# EAGLE design Squidpad (EAGLE 7.2.0)
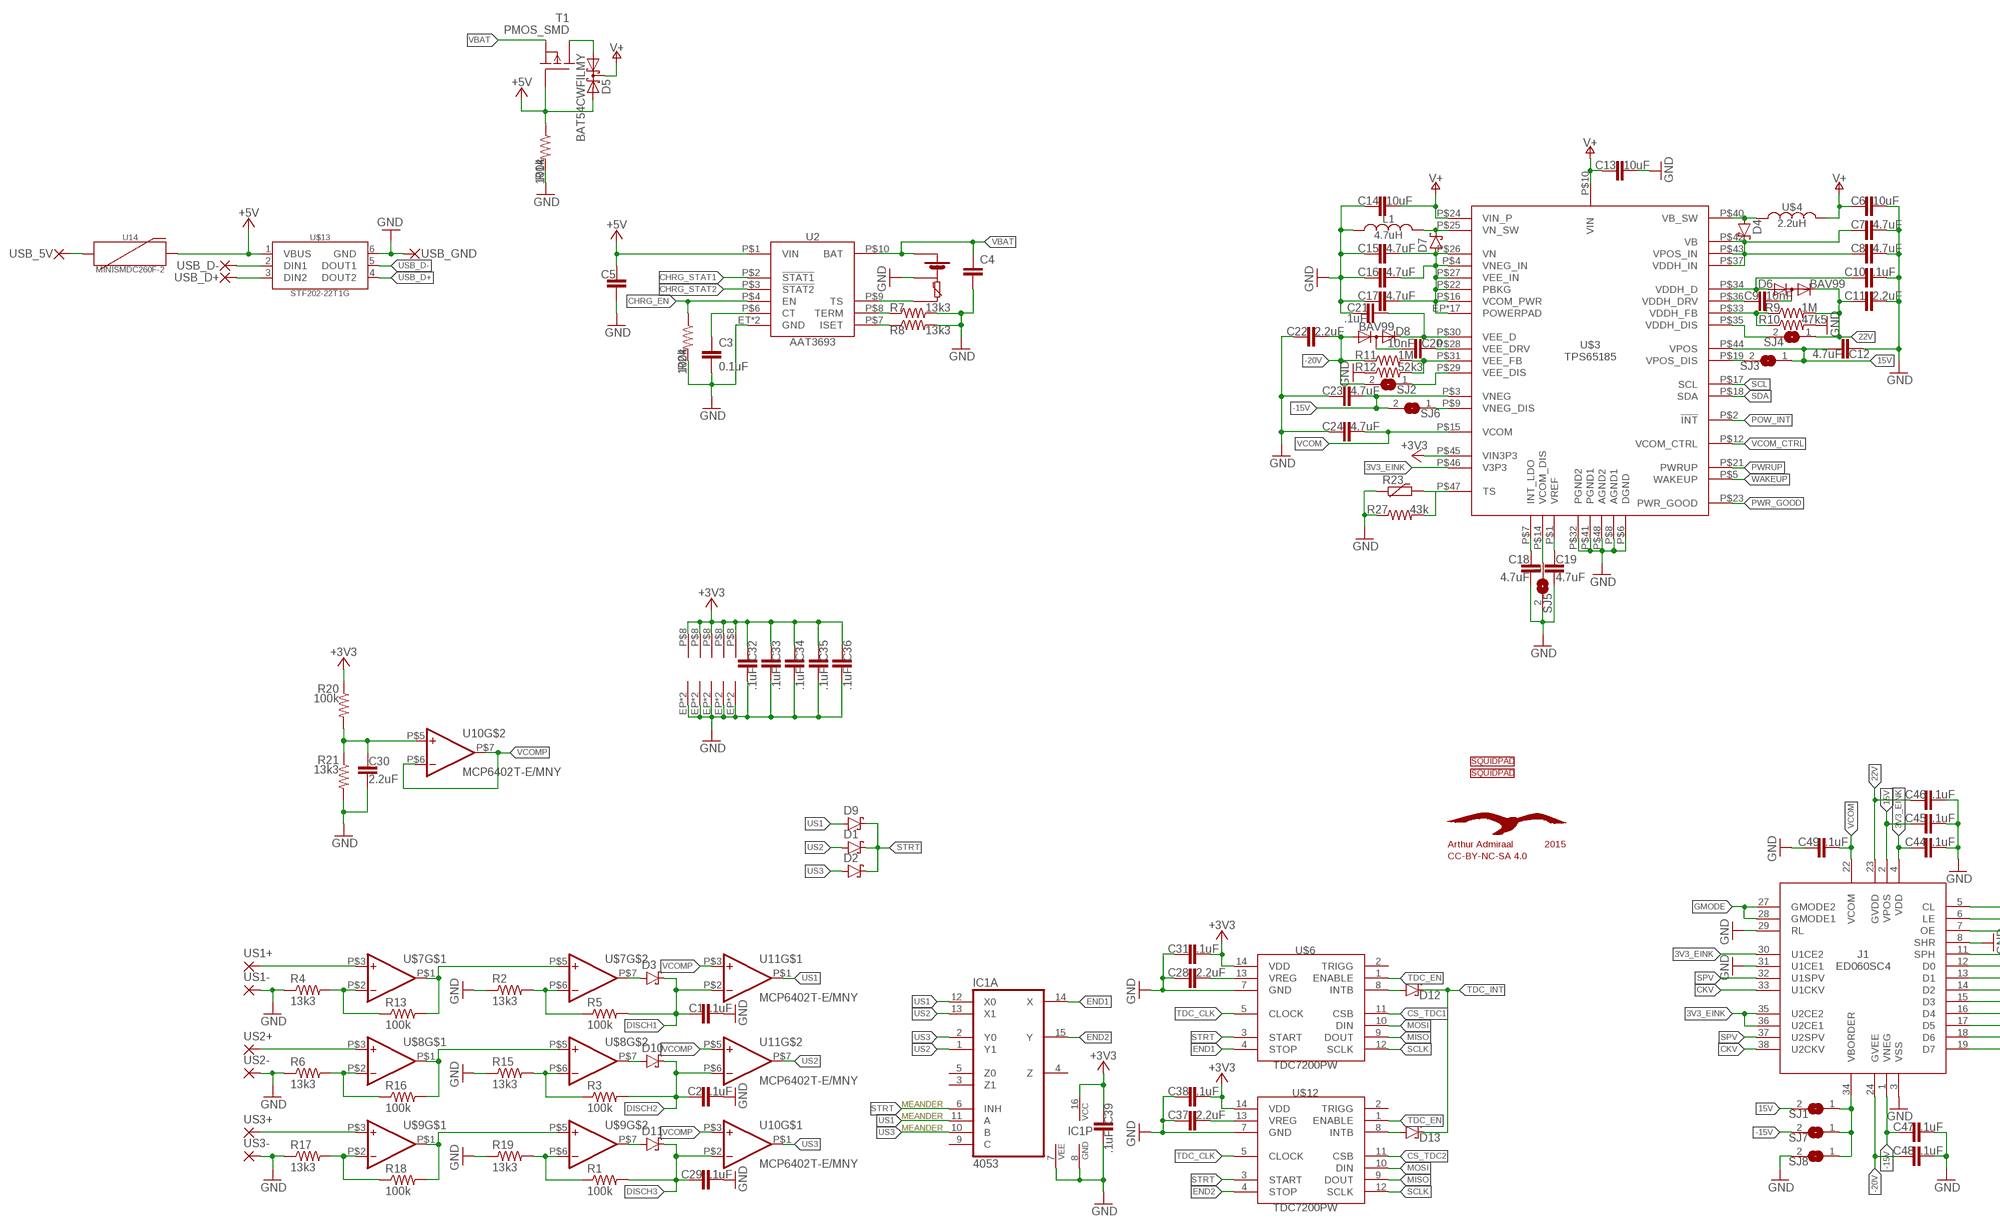
[diagram p0: schematic, sheet 1, part 1 of 2]
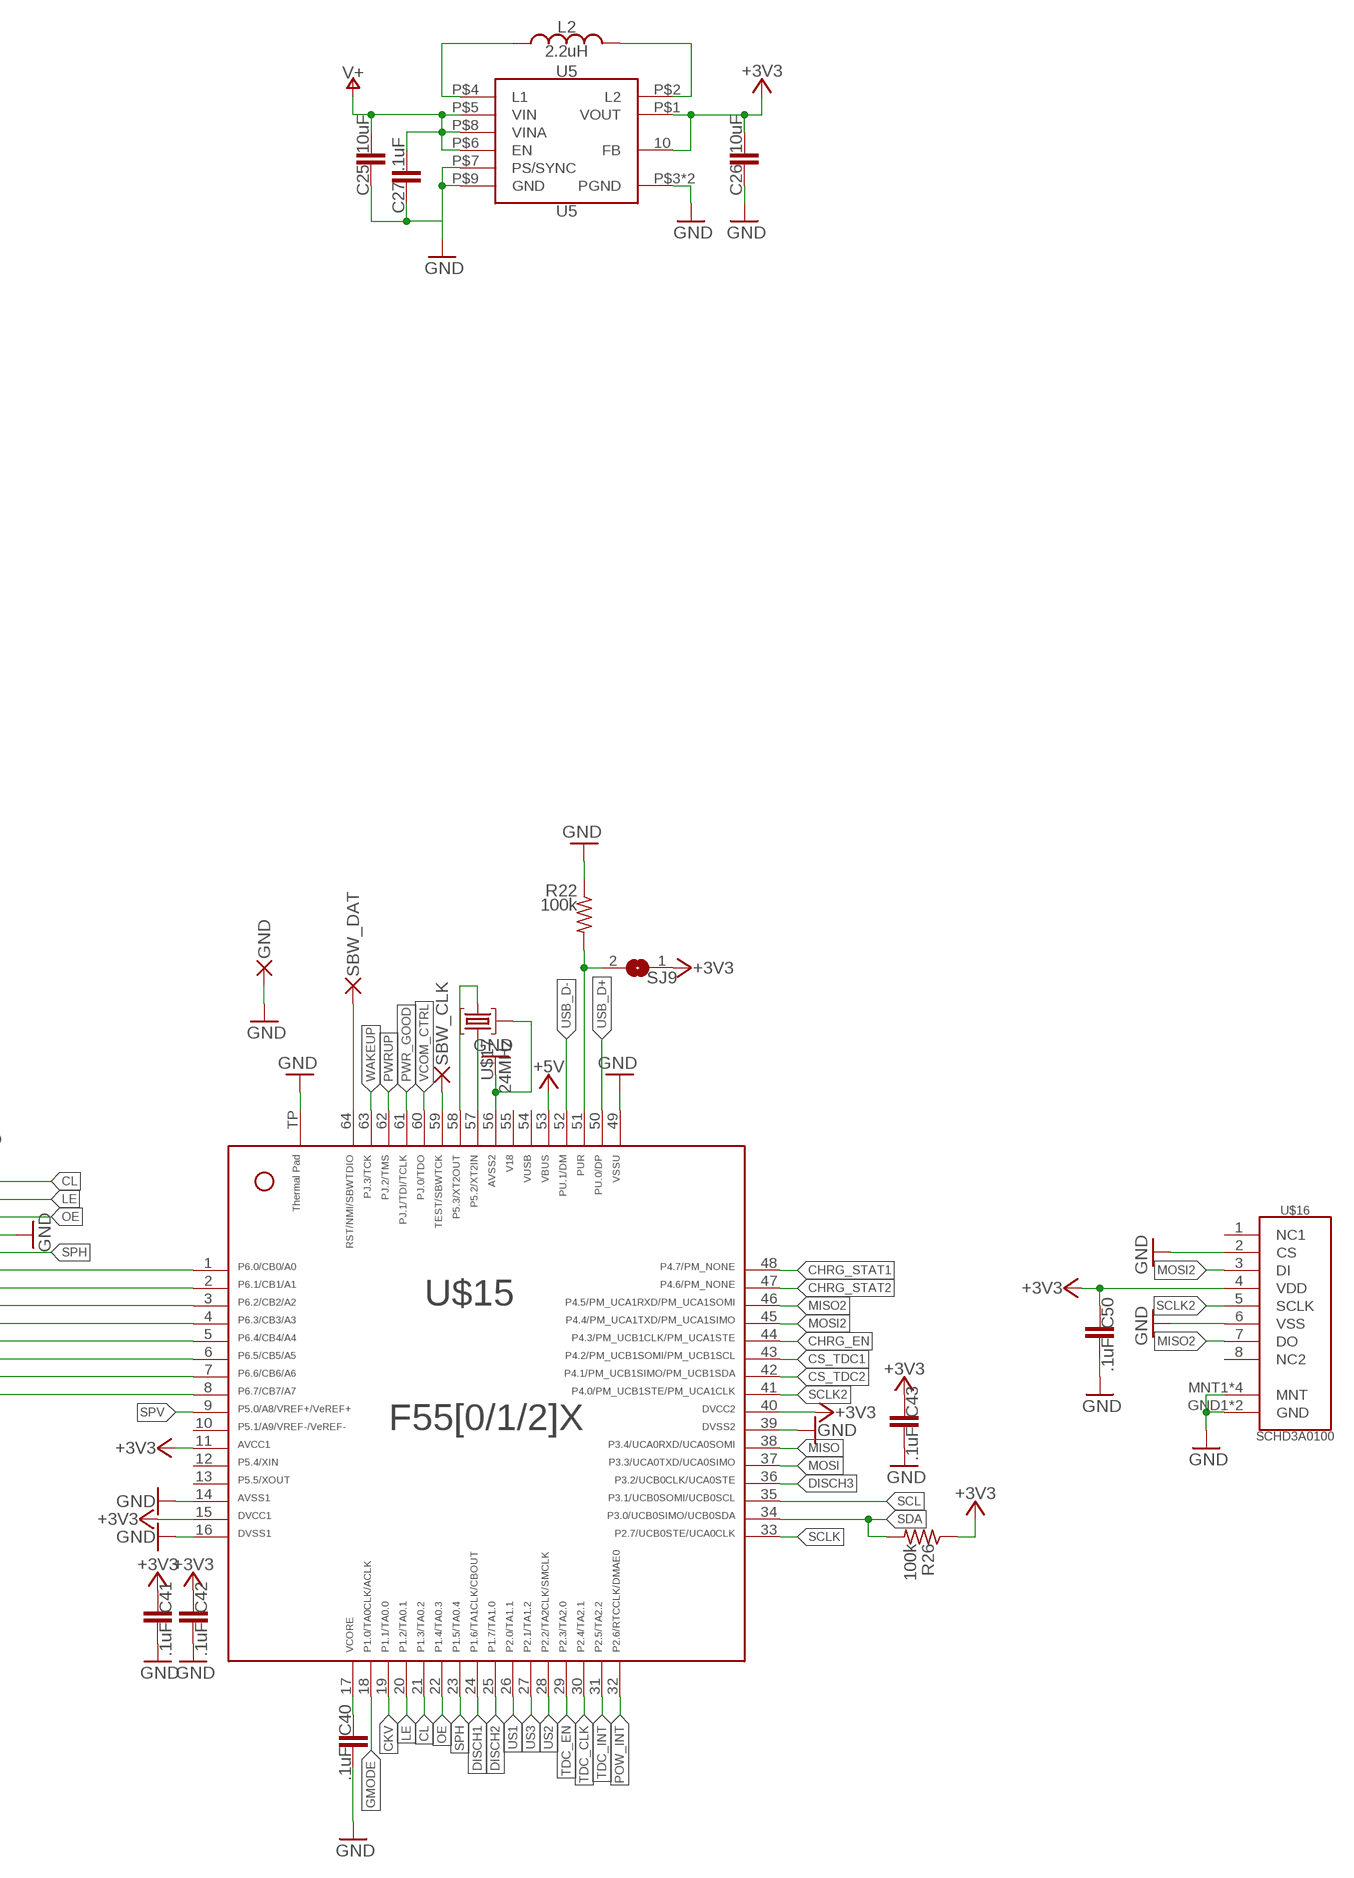
[diagram p1: schematic, sheet 1, part 2 of 2]

## Parts
C1  .1uF  C-EUC0805K  [C0805K]
C2  .1uF  C-EUC0805K  [C0805K]
C3  0.1uF  CAP0603-CAP  [0603-CAP]
C4  CAP0603-CAP  [0603-CAP]
C5  CAP0603-CAP  [0603-CAP]
C6  10uF  C-EUC0805K  [C0805K]
C7  4.7uF  C-EUC0805K  [C0805K]
C8  4.7uF  C-EUC0805K  [C0805K]
C9  10nF  C-EUC0603K  [C0603K]
C10  .1uF  C-EUC0805K  [C0805K]
C11  2.2uF  C-EUC0603K  [C0603K]
C12  4.7uF  C-EUC0805K  [C0805K]
C13  10uF  C-EUC0805K  [C0805K]
C14  10uF  C-EUC0805K  [C0805K]
C15  4.7uF  C-EUC0805K  [C0805K]
C16  4.7uF  C-EUC0805K  [C0805K]
C17  4.7uF  C-EUC0805K  [C0805K]
C18  4.7uF  C-EUC0805K  [C0805K]
C19  4.7uF  C-EUC0805K  [C0805K]
C20  10nF  C-EUC0603K  [C0603K]
C21  .1uF  C-EUC0805K  [C0805K]
C22  2.2uF  C-EUC0603K  [C0603K]
C23  4.7uF  C-EUC0805K  [C0805K]
C24  4.7uF  C-EUC0805K  [C0805K]
C25  10uF  C-EUC0805K  [C0805K]
C26  10uF  C-EUC0805K  [C0805K]
C27  .1uF  C-EUC0805K  [C0805K]
C28  2.2uF  C-EUC0603K  [C0603K]
C29  .1uF  C-EUC0805K  [C0805K]
C30  2.2uF  C-EUC0603K  [C0603K]
C31  .1uF  C-EUC0805K  [C0805K]
C32  .1uF  C-EUC0805K  [C0805K]
C33  .1uF  C-EUC0805K  [C0805K]
C34  .1uF  C-EUC0805K  [C0805K]
C35  .1uF  C-EUC0805K  [C0805K]
C36  .1uF  C-EUC0805K  [C0805K]
C37  2.2uF  C-EUC0603K  [C0603K]
C38  .1uF  C-EUC0805K  [C0805K]
C39  .1uF  C-EUC0805K  [C0805K]
C40  .1uF  C-EUC0805K  [C0805K]
C41  .1uF  C-EUC0805K  [C0805K]
C42  .1uF  C-EUC0805K  [C0805K]
C43  .1uF  C-EUC0805K  [C0805K]
C44  .1uF  C-EUC0805K  [C0805K]
C45  .1uF  C-EUC0805K  [C0805K]
C46  .1uF  C-EUC0805K  [C0805K]
C47  .1uF  C-EUC0805K  [C0805K]
C48  .1uF  C-EUC0805K  [C0805K]
C49  .1uF  C-EUC0805K  [C0805K]
C50  .1uF  C-EUC0805K  [C0805K]
D1  MBR130T3G  [SOD123]
D2  MBR130T3G  [SOD123]
D3  MBR130T3G  [SOD123]
D4  MBR130T3G  [SOD123]
D5  BAT54CWFILMY  HSMS-285F  [SOT323]
D6  BAV99  BAV199  [SOT23]
D7  MBR130T3G  [SOD123]
D8  BAV99  BAV199  [SOT23]
D9  MBR130T3G  [SOD123]
D10  MBR130T3G  [SOD123]
D11  MBR130T3G  [SOD123]
D12  MBR130T3G  [SOD123]
D13  MBR130T3G  [SOD123]
GND  SMD2  [SMD1,27-2,54]
IC1  4053  [TSSOP16]
J1  ED060SC4  [FH26-39S-0.3SHW(05)]
L1  4.7uH  LQH44P  [LQH44P]
L2  2.2uH  NR4012  [NR4012]
R1  100k  R-US_R0603  [R0603]
R2  13k3  R-US_R1206  [R1206]
R3  100k  R-US_R0603  [R0603]
R4  13k3  R-US_R1206  [R1206]
R5  100k  R-US_R0603  [R0603]
R6  13k3  R-US_R1206  [R1206]
R7  13k3  R-US_R0603  [R0603]
R8  13k3  R-US_R0603  [R0603]
R9  1M  R-US_R0603  [R0603]
R10  47k5  R-US_R0603  [R0603]
R11  1M  R-US_R0603  [R0603]
R12  52k3  R-US_R0603  [R0603]
R13  100k  R-US_R0603  [R0603]
R14  100k  R-US_R0603  [R0603]
R15  13k3  R-US_R1206  [R1206]
R16  100k  R-US_R0603  [R0603]
R17  13k3  R-US_R1206  [R1206]
R18  100k  R-US_R0603  [R0603]
R19  13k3  R-US_R1206  [R1206]
R20  100k  R-US_R0603  [R0603]
R21  13k3  R-US_R1206  [R1206]
R22  100k  R-US_R0603  [R0603]
R23  R-EU_R0603  [R0603]
R24  100k  R-US_R0603  [R0603]
R26  100k  R-US_R0603  [R0603]
R27  43k  R-US_R0603  [R0603]
SBW_CLK  SMD2  [SMD1,27-2,54]
SBW_DAT  SMD2  [SMD1,27-2,54]
SJ1  SJ  [SJ]
SJ2  SJ  [SJ]
SJ3  SJ  [SJ]
SJ4  SJ  [SJ]
SJ5  SJ  [SJ]
SJ6  SJ  [SJ]
SJ7  SJ  [SJ]
SJ8  SJ  [SJ]
SJ9  SJ  [SJ]
T1  PMOS_SMD  [SOT323R_INFINEON]
U2  AAT3693  [TDFN14]
U5  TPS63031  [R-PWSON-N10]
U10  MCP6402T-E/MNY  [TFDN8]
U11  MCP6402T-E/MNY  [TFDN8]
U14  MINISMDC260F-2  [MINISMDC260F-2]
U$1  IPOD_NANO_5_BATTERY  [IPOD_NANO_5_BATTERY]
U$2  SQUIDPAD_LOGOSQUIDPAD_LOGO_SMALL  [SQUIDPAD_LOGO_LOWPOLY_SMALL]
U$3  TPS65185  [VQFN48]
U$4  2.2uH  NR4012  [NR4012]
U$5  SQUIDPAD_LOGOSQUIDPAD_LOGO  [SQUIDPAD_LOGO_LOWPOLY]
U$6  TDC7200PW  [TSSOP14]
U$7  MCP6402T-E/MNY  [TFDN8]
U$8  MCP6402T-E/MNY  [TFDN8]
U$9  MCP6402T-E/MNY  [TFDN8]
U$10  AALECTRONICS_SEAGULL  [AALECTRONICS_SEAGULL]
U$12  TDC7200PW  [TSSOP14]
U$13  STF202-22T1G  [SOT23-6]
U$15  F55[0/1/2]X---RGC64  [RGC64]
U$16  SCHD3A0100  [SCHD3A0100]
U$17  24MHz  CRYSTAL_TSX-3225  [TSX-3225]
US1+  SMD2  [SMD1,27-2,54]
US1-  SMD2  [SMD1,27-2,54]
US2+  SMD2  [SMD1,27-2,54]
US2-  SMD2  [SMD1,27-2,54]
US3+  SMD2  [SMD1,27-2,54]
US3-  SMD2  [SMD1,27-2,54]
USB_5V  SMD2  [SMD1,27-2,54]
USB_D+  SMD2  [SMD1,27-2,54]
USB_D-  SMD2  [SMD1,27-2,54]
USB_GND  SMD2  [SMD1,27-2,54]

## Nets
3V3: C6.1 C13.1 C14.2 C25.2 C27.2 D5.3(C) U5.P$5(VIN) U5.P$6(EN) U5.P$8(VINA) U$3.P$10(VIN) U$3.P$24(VIN_P) U$4.P$2 ; supply symbol labelled V+
3V3_EINK: C44.1 J1.4(VDD) J1.30(U1CE2) J1.35(U2CE2) J1.36(U2CE1) U$3.P$46(V3P3)
15V: C12.2 C45.1 J1.2(VPOS) SJ1.2 SJ3.1 U$3.P$44(VPOS)
22V: C11.1 C46.1 D6.2(C) J1.23(GVDD) R9.2 SJ4.1
+3V3: C26.2 C31.2 C32.1 C33.1 C34.1 C35.1 C36.1 C38.2 C39.1 C41.1 C42.1 C43.1 C50.1 IC1.16(P:VCC) R20.1 R26.1 SJ9.1 U5.10(FB) U5.P$1(VOUT) U10.P$8(V+) U11.P$8(V+) U$3.P$45(VIN3P3) U$6.14(VDD) U$7.P$8(V+) U$8.P$8(V+) U$9.P$8(V+) U$12.14(VDD) U$15.11 U$15.15 U$15.40 U$16.4(VDD)
+5V: C5.1 D5.2(A2) R14.1 T1.1(G) U2.P$1(VIN) U14.P$2 U$13.1(VBUS) U$15.53
-15V: C23.2 C47.1 J1.1(VNEG) SJ6.2 SJ7.2 U$3.P$3(VNEG)
-20V: C22.2 C48.1 D8.1(A) J1.24(GVEE) R11.1 SJ2.2
CHRG_EN: R24.1 U2.P$4(EN) U$15.44
CHRG_STAT1: U2.P$2(!STAT1) U$15.48
CHRG_STAT2: U2.P$3(!STAT2) U$15.47
CKV: J1.33(U1CKV) J1.38(U2CKV) U$15.19
CL: J1.5(CL) U$15.21
CS_TDC1: U$6.11(CSB) U$15.43
CS_TDC2: U$12.11(CSB) U$15.42
D0: J1.12(D0) U$15.1
D1: J1.13(D1) U$15.2
D2: J1.14(D2) U$15.3
D3: J1.15(D3) U$15.4
D4: J1.16(D4) U$15.5
D5: J1.17(D5) U$15.6
D6: J1.18(D6) U$15.7
D7: J1.19(D7) U$15.8
DISCH1: C1.1 D3.1(C) R5.2 U11.P$2(-IN) U$15.24
DISCH2: C2.1 D10.1(C) R3.2 U11.P$6(-IN) U$15.25
DISCH3: C29.1 D11.1(C) R1.2 U10.P$2(-IN) U$15.36
END1: IC1.14(A:X) U$6.4(STOP)
END2: IC1.15(A:Y) U$12.4(STOP)
GMODE: J1.27(GMODE2) J1.28(GMODE1) U$15.18
GND: C1.2 C2.2 C3.2 C4.2 C5.2 C6.2 C7.2 C8.2 C10.2 C11.2 C12.1 C13.2 C14.1 C15.1 C16.1 C17.1 C18.1 C19.1 C21.1 C22.1 C23.1 C24.1 C25.1 C26.1 C27.1 C28.1 C29.2 C30.2 C31.1 C32.2 C33.2 C34.2 C35.2 C36.2 C37.1 C38.1 C39.2 C40.2 C41.2 C42.2 C43.2 C44.2 C45.2 C46.2 C47.2 C48.2 C49.1 C50.2 GND.1(P) IC1.7(P:VEE) IC1.8(P:GND) J1.3(VSS) J1.8(SHR) J1.29(RL) J1.31(U1CE1) L1.P$1 R2.1 R4.1 R6.1 R7.2 R8.2 R10.2 R12.1 R14.2 R15.1 R17.1 R19.1 R21.2 R22.1 R23.1 R24.2 R27.1 SJ5.2 SJ8.2 U2.ET(GND) U2.P$5(GND) U5.P$3(PGND) U5.P$7(PS/SYNC) U5.P$9(GND) U5.POWERPAD(PGND) U10.EP(V-) U10.P$4(V-) U11.EP(V-) U11.P$4(V-) U$1.P-(BATTERY-) U$3.P$6(DGND) U$3.P$8(AGND1) U$3.P$32(PGND2) U$3.P$41(PGND1) U$3.P$48(AGND2) U$6.7(GND) U$7.EP(V-) U$7.P$4(V-) U$8.EP(V-) U$8.P$4(V-) U$9.EP(V-) U$9.P$4(V-) U$12.7(GND) U$13.6(GND) U$15.14 U$15.16 U$15.39 U$15.49 U$15.56 U$15.TP U$16.2(CS) U$16.6(VSS) U$16.GND1(GND) U$16.GND2(GND) U$16.MNT1(MNT) U$16.MNT2(MNT) U$16.MNT3(MNT) U$16.MNT4(MNT) U$17.2 U$17.3 US1-.1(P) US2-.1(P) US3-.1(P) USB_GND.1(P)
LE: J1.6(LE) U$15.20
MISO: U$6.9(DOUT) U$12.9(DOUT) U$15.38
MISO2: U$15.46 U$16.7(DO)
MOSI: U$6.10(DIN) U$12.10(DIN) U$15.37
MOSI2: U$15.45 U$16.3(DI)
N$1: U$7.P$3(+IN) US1+.1(P)
N$2: R2.2 R5.1 U$7.P$6(-IN)
N$3: D12.2(A) U$6.8(INTB)
N$4: U$8.P$3(+IN) US2+.1(P)
N$5: R6.2 R16.1 U$8.P$2(-IN)
N$6: R16.2 U$8.P$1(OUT) U$8.P$5(+IN)
N$7: D4.2(A) U$3.P$40(VB_SW) U$4.P$1
N$8: U2.P$9(TS) U$1.TH(TEMP)
N$9: U$13.3(DIN2) USB_D+.1(P)
N$10: U$13.2(DIN1) USB_D-.1(P)
N$11: U$15.57 U$17.4
N$12: R7.1 U2.P$8(TERM)
N$13: R8.1 U2.P$7(ISET)
N$14: C7.1 C8.1 D4.1(C) U$3.P$37(VDDH_IN) U$3.P$42(VB) U$3.P$43(VPOS_IN)
N$15: D3.2(A) U$7.P$7(OUT)
N$16: D13.2(A) U$12.8(INTB)
N$17: C3.1 U2.P$6(CT)
N$18: C10.1 D6.1(A) U$3.P$34(VDDH_D)
N$19: D5.1(A1) T1.3(D)
N$20: C9.1 U$3.P$36(VDDH_DRV)
N$21: C9.2 D6.3(AC)
N$22: R9.1 R10.1 U$3.P$33(VDDH_FB)
N$23: C20.2 D8.3(AC)
N$24: D7.1(C) L1.P$2 U$3.P$25(VN_SW)
N$25: C15.2 C16.2 C17.2 D7.2(A) U$3.EP1(POWERPAD) U$3.EP2(POWERPAD) U$3.EP3(POWERPAD) U$3.EP4(POWERPAD) U$3.EP5(POWERPAD) U$3.EP6(POWERPAD) U$3.EP7(POWERPAD) U$3.EP8(POWERPAD) U$3.EP9(POWERPAD) U$3.EP10(POWERPAD) U$3.EP11(POWERPAD) U$3.EP12(POWERPAD) U$3.EP13(POWERPAD) U$3.EP14(POWERPAD) U$3.EP15(POWERPAD) U$3.EP16(POWERPAD) U$3.EP(POWERPAD) U$3.P$4(VNEG_IN) U$3.P$16(VCOM_PWR) U$3.P$22(PBKG) U$3.P$26(VN) U$3.P$27(VEE_IN)
N$26: C18.2 U$3.P$7(INT_LDO)
N$27: C19.2 U$3.P$1(VREF)
N$28: C21.2 D8.2(C) U$3.P$30(VEE_D)
N$29: SJ6.1 U$3.P$9(VNEG_DIS)
N$30: L2.P$1 U5.P$4(L1)
N$31: C20.1 U$3.P$28(VEE_DRV)
N$32: R11.2 R12.2 U$3.P$31(VEE_FB)
N$33: SJ2.1 U$3.P$29(VEE_DIS)
N$34: SJ3.2 U$3.P$19(VPOS_DIS)
N$35: SJ4.2 U$3.P$35(VDDH_DIS)
N$36: SJ5.1 U$3.P$14(VCOM_DIS)
N$37: L2.P$2 U5.P$2(L2)
N$38: C28.2 U$6.13(VREG)
N$39: R4.2 R13.1 U$7.P$2(-IN)
N$40: R13.2 U$7.P$1(OUT) U$7.P$5(+IN)
N$41: R3.1 R15.2 U$8.P$6(-IN)
N$42: U14.P$1 USB_5V.1(P)
N$43: U$9.P$3(+IN) US3+.1(P)
N$44: R17.2 R18.1 U$9.P$2(-IN)
N$45: R18.2 U$9.P$1(OUT) U$9.P$5(+IN)
N$46: R1.1 R19.2 U$9.P$6(-IN)
N$47: D10.2(A) U$8.P$7(OUT)
N$48: D11.2(A) U$9.P$7(OUT)
N$49: C37.2 U$12.13(VREG)
N$50: J1.34(VBORDER) SJ1.1 SJ7.1 SJ8.1
N$51: SBW_DAT.1(P) U$15.64
N$52: SBW_CLK.1(P) U$15.59
N$53: C40.1 U$15.17
N$54: R22.2 SJ9.2 U$15.51
N$56: U$15.58 U$17.1
N$57: R23.2 R27.2 U$3.P$47(TS)
OE: J1.7(OE) U$15.22
POW_INT: U$3.P$2(!INT) U$15.32
PWR_GOOD: U$3.P$23(PWR_GOOD) U$15.61
PWRUP: U$3.P$21(PWRUP) U$15.62
SCL: U$3.P$17(SCL) U$15.35
SCLK: U$6.12(SCLK) U$12.12(SCLK) U$15.33
SCLK2: U$15.41 U$16.5(SCLK)
SDA: R26.2 U$3.P$18(SDA) U$15.34
SPH: J1.11(SPH) U$15.23
SPV: J1.32(U1SPV) J1.37(U2SPV) U$15.9
STRT: D1.1(C) D2.1(C) D9.1(C) IC1.6(A:INH) U$6.3(START) U$12.3(START)
TDC_CLK: U$6.5(CLOCK) U$12.5(CLOCK) U$15.30
TDC_EN: U$6.1(ENABLE) U$12.1(ENABLE) U$15.29
TDC_INT: D12.1(C) D13.1(C) U$15.31
US1: D9.2(A) IC1.11(A:A) IC1.12(A:X0) U11.P$1(OUT) U$15.26
US2: D1.2(A) IC1.1(A:Y1) IC1.13(A:X1) U11.P$7(OUT) U$15.28
US3: D2.2(A) IC1.2(A:Y0) IC1.10(A:B) U10.P$1(OUT) U$15.27
USB_D+: U$13.4(DOUT2) U$15.50
USB_D-: U$13.5(DOUT1) U$15.52
VBAT: C4.1 T1.2(S) U2.P$10(BAT) U$1.P+(BATTERY+)
VCOM: C24.2 C49.2 J1.22(VCOM) U$3.P$15(VCOM)
VCOM_CTRL: U$3.P$12(VCOM_CTRL) U$15.60
VCOMP: U10.P$3(+IN) U10.P$6(-IN) U10.P$7(OUT) U11.P$3(+IN) U11.P$5(+IN)
VCOMP_BEFORE: C30.1 R20.2 R21.1 U10.P$5(+IN)
WAKEUP: U$3.P$5(WAKEUP) U$15.63
Unconnected: IC1.3(A:Z1) IC1.4(A:Z) IC1.5(A:Z0) IC1.9(A:C) U$6.2(TRIGG) U$12.2(TRIGG) U$15.10 U$15.12 U$15.13 U$16.1(NC1) U$16.8(NC2)

## Notes on the sheet
- MEANDER
- MEANDER
- MEANDER

## Power pins joined to a net without a drawn wire
54: U$15.54
55: U$15.55

## Library data of the parts
C1 C2 C6-C50 = rcl:C-EU: CAPACITOR, European symbol
C3-C5 = SparkFun-Capacitors:CAP: Capacitor Standard 0603 ceramic capacitor, and 0.1" leaded capacitor.
D1-D4 D7 D9-D13 = aalectronics:MBR130T3G
D5 = avago:HSMS-285F: Surface Mount Microwave Schottky Detector Diodes Source: Data sheet <http://www.farnell.com/datasheets/461166.pdf>
D6 D8 = diode:BAV199: DIODE low-leakage double diode
GND SBW_CLK SBW_DAT US1+ US1- US2+ US2- US3+ US3- USB_5V USB_D+ USB_D- USB_GND = wirepad:SMD2: SMD PAD
IC1 = aalectronics:4053: Triple 2-channel ANALOG MULTIPLEXER
J1 = aalectronics:ED060SC4
L1 = aalectronics:LQH44P
L2 U$4 = aalectronics:NR4012
R1 R3 R5 R9-R13 R16 R18 R20 R22 R26 R27 = rcl:R-US_: RESISTOR, American symbol
R2 R4 R6-R8 R14 R15 R17 R19 R21 R24 = resistor:R-US_: RESISTOR, American symbol
R23 = rcl:R-EU_: RESISTOR, European symbol
SJ1-SJ9 = jumper:SJ: SMD solder JUMPER
T1 = aalectronics:PMOS_SMD
U2 = aalectronics:AAT3693
U5 = aalectronics:TPS63031
U10 U11 U$7-U$9 = aalectronics:MCP6402T-E/MNY
U14 = aalectronics:MINISMDC260F-2
U$1 = aalectronics:IPOD_NANO_5_BATTERY
U$2 U$5 = aalectronics:SQUIDPAD_LOGO
U$3 = aalectronics:TPS65185
U$6 U$12 = aalectronics:TDC7200PW
U$10 = aalectronics:AALECTRONICS_SEAGULL
U$13 = aalectronics:STF202-22T1G
U$15 = TI_MSP430_v16:F55[0/1/2]X---RGC64: ***F55[0/1/2]X***RGC64 Rev. 1.0 06/2010 "http://www.ti.com/lit/gpn/msp430f5529" "http://www.ti.com/lit/gpn/msp430f5509" F5513/F5514 with limited Functions on some Pins
U$16 = aalectronics:SCHD3A0100
U$17 = aalectronics:CRYSTAL_TSX-3225

## Board
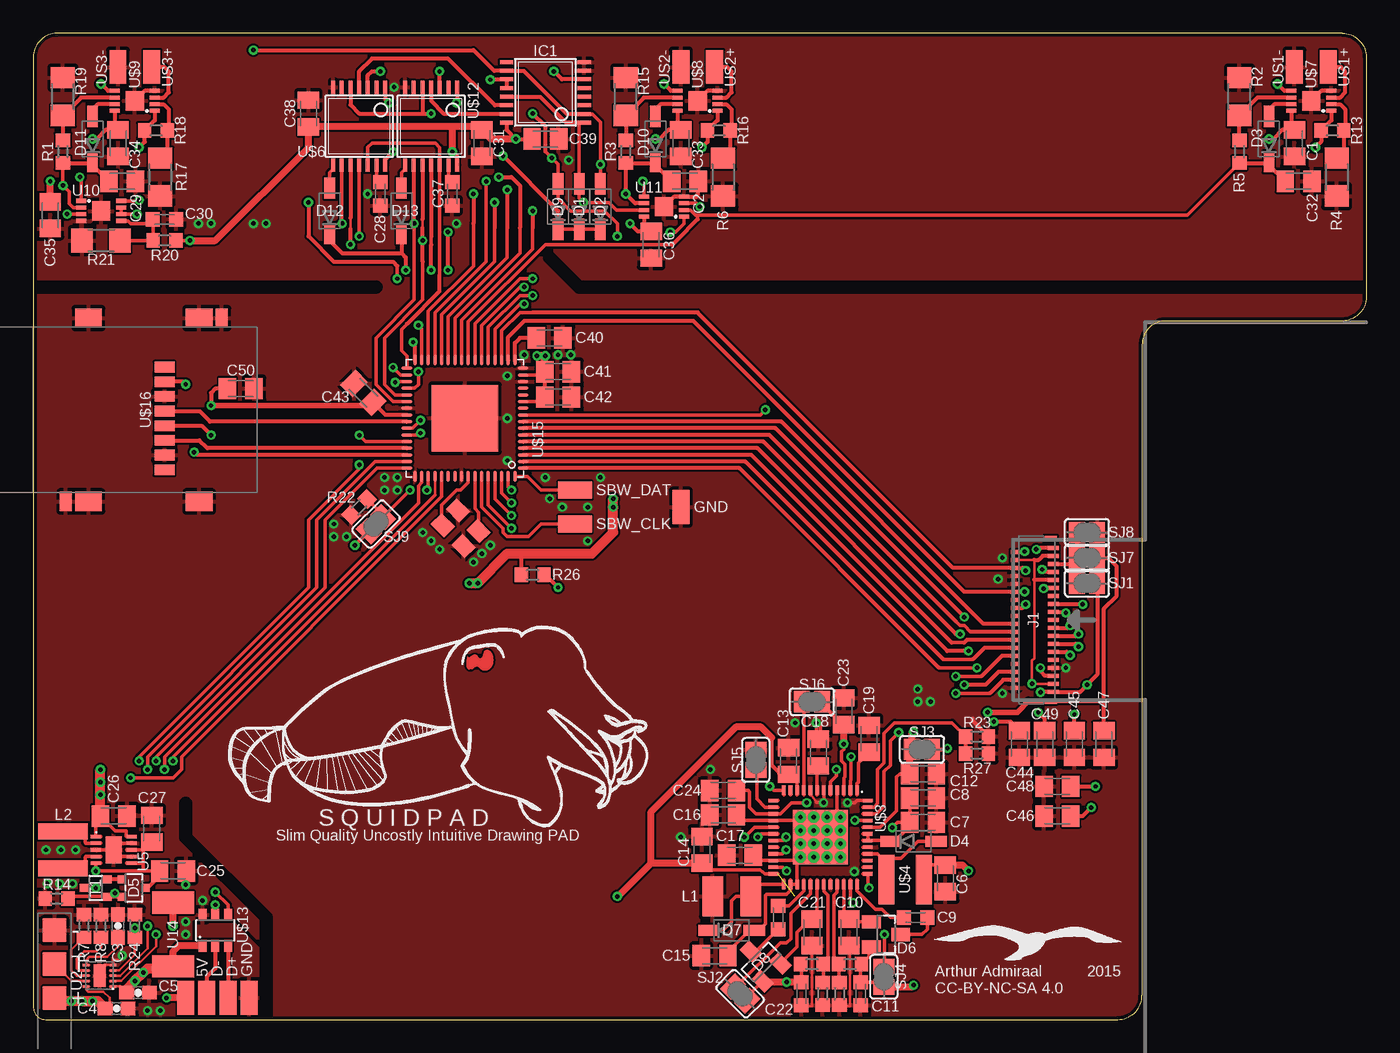
[diagram p2: board, top side]
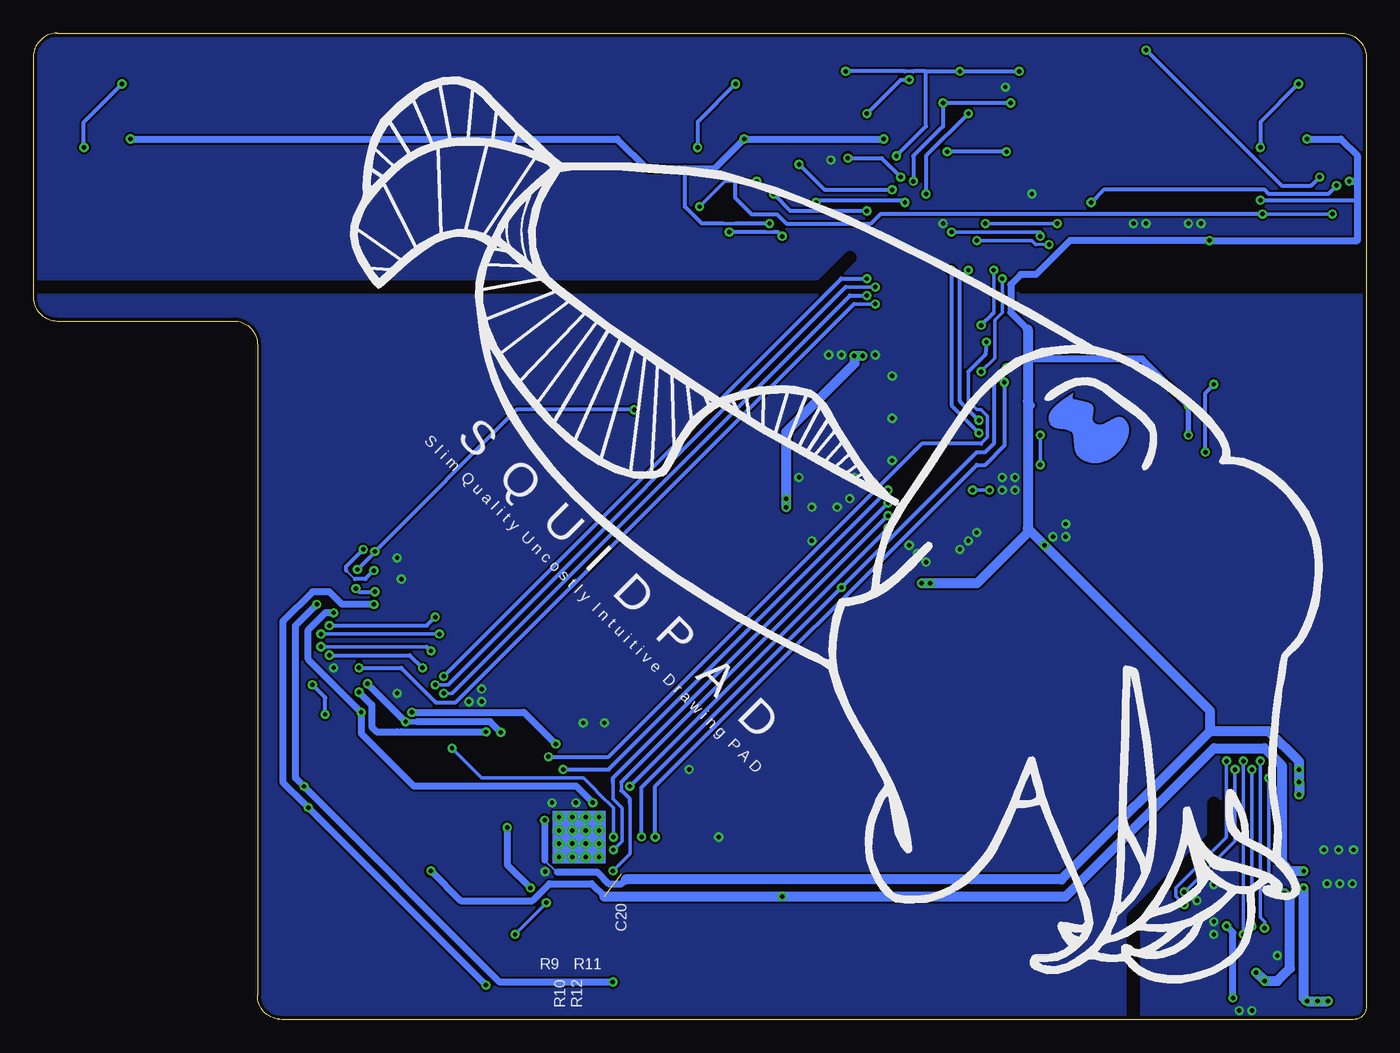
[diagram p3: board, bottom side, seen from below]

Size 100 x 74 mm. Coordinates in mm from the lower left corner, seen from the top.
Outline: 0,72.21 0,0.92 arc90 0.92,0 81.37,0 arc90 83.19,1.82 83.19,50.62 arc-90 84.98,52.42 98.21,52.42 arc90 100,54.21 100,72.22 arc90 98.22,74 1.79,74 arc90 0,72.21
Copper layers (1*16): Top 0.035mm / dielectric 1.5mm / Bottom 0.035mm
Design rules "itead": minimum track width 6mil, minimum drill 12mil, track to track 6mil, track to pad 6mil, pad to pad 6mil, via to via 6mil, smd to smd 0mil, copper to edge 10mil, drill to drill 10mil, minimum pad ring 10mil, minimum via ring 6mil, stop-mask expansion 2mil, vias tented up to drill 100mil, thermal gap 10mil
tRestrict: 9 lines
bRestrict: 6 lines

### Footprints (pad centres in the part's own frame; a part is rotated, then mirrored left to right if it is on the bottom)
C0805K = smd 1.3 x 1.6: 1 -1,0; 2 1,0
0603-CAP = smd 1.1 x 1: 1 -0.85,0; 2 0.85,0
C0603K = smd 1.05 x 1.08: 1 -0.875,0; 2 0.875,0
SOD123 = smd 1.6 x 0.8: 1 -1.7,0; 2 1.7,0
SOT323 = smd 0.6 x 0.55: 1 -0.65,-0.925; 2 0.65,-0.925; 3 0,0.925
SOT23 = smd 1 x 1.4: 1 -0.95,-1.1; 2 0.95,-1.1; 3 0,1.1
SMD1,27-2,54 = smd 1.27 x 2.54: 1 0,0
TSSOP16 = smd 0.305 x 0.991: 1 -2.275,-2.918; 2 -1.625,-2.918; 3 -0.975,-2.918; 4 -0.325,-2.918; 5 0.325,-2.918; 6 0.975,-2.918; 7 1.625,-2.918; 8 2.275,-2.918; 9 2.275,2.918; 10 1.625,2.918; 11 0.975,2.918; 12 0.325,2.918; 13 -0.325,2.918; 14 -0.975,2.918; 15 -1.625,2.918; 16 -2.275,2.918
FH26-39S-0.3SHW(05) = smd 0.4 x 0.95: 1 -6.1,-2.325; 39 6.1,-2.325 | smd 0.3 x 0.8: 2 -5.4,-2.525; 4 -4.8,-2.525; 6 -4.2,-2.525; 8 -3.6,-2.525; 10 -3,-2.525; 12 -2.4,-2.525; 14 -1.8,-2.525; 16 -1.2,-2.525; 18 -0.6,-2.525; 20 0,-2.525; 22 0.6,-2.525; 24 1.2,-2.525; 26 1.8,-2.525; 28 2.4,-2.525; 30 3,-2.525; 32 3.6,-2.525; 34 4.2,-2.525; 36 4.8,-2.525; 38 5.4,-2.525 | smd 0.3 x 0.65: 3 -5.1,0.35; 5 -4.5,0.35; 7 -3.9,0.35; 9 -3.3,0.35; 11 -2.7,0.35; 13 -2.1,0.35; 15 -1.5,0.35; 17 -0.9,0.35; 19 -0.3,0.35; 21 0.3,0.35; 23 0.9,0.35; 25 1.5,0.35; 27 2.1,0.35; 29 2.7,0.35; 31 3.3,0.35; 33 3.9,0.35; 35 4.5,0.35; 37 5.1,0.35
LQH44P = smd 1.55 x 3: P$1 -1.425,0; P$2 1.425,0
NR4012 = smd 1.2 x 3.7: P$1 -1.4,0; P$2 1.4,0
R0603 = smd 1 x 1.1: 1 -0.85,0; 2 0.85,0
R1206 = smd 1.6 x 1.803: 1 -1.422,0; 2 1.422,0
SJ = smd 1.168 x 1.6: 1 -0.762,0; 2 0.762,0
SOT323R_INFINEON = smd 0.6 x 0.8: 1 -0.65,-0.8; 2 0,0.8; 3 0.65,-0.8
TDFN14 = smd 0.9 x 1.7: ET 0,0 | smd 0.465 x 0.18: P$1 -1.022,0.8; P$2 -1.022,0.4; P$3 -1.022,0; P$4 -1.022,-0.4; P$5 -1.022,-0.8; P$6 1.022,-0.8; P$7 1.022,-0.4; P$8 1.022,0; P$9 1.022,0.4; P$10 1.022,0.8
R-PWSON-N10 = smd 0.73 x 0.28: 10 1.355,1; P$1 -1.355,1; P$2 -1.355,0.5; P$3 -1.355,0; P$4 -1.355,-0.5; P$5 -1.355,-1; P$6 1.355,-1; P$7 1.355,-0.5; P$8 1.355,0; P$9 1.355,0.5 | smd 1.2 x 2: POWERPAD 0,0
TFDN8 = smd 1.46 x 1.36: EP 0,0 | smd 0.3 x 0.75: P$1 -0.75,-1.5; P$2 -0.25,-1.5; P$3 0.25,-1.5; P$4 0.75,-1.5; P$5 0.75,1.5; P$6 0.25,1.5; P$7 -0.25,1.5; P$8 -0.75,1.5
MINISMDC260F-2 = smd 1.68 x 3.15: P$1 -2.39,0; P$2 2.39,0
IPOD_NANO_5_BATTERY = smd 1.778 x 1.778: P+ 5.08,0; P- 0,0; TH 2.54,0
VQFN48 = smd 4.1 x 4.1: EP 0,0 | drill 0.33: EP1 -1.5,1.5; EP2 -0.5,1.5; EP3 0.5,1.5; EP4 1.5,1.5; EP5 1.5,0.5; EP6 1.5,-0.5; EP7 1.5,-1.5; EP8 0.5,-1.5; EP9 -0.5,-1.5; EP10 -1.5,-1.5; EP11 -1.5,-0.5; EP12 -1.5,0.5; EP13 0.5,-0.5; EP14 -0.5,0.5; EP15 0.5,0.5; EP16 -0.5,-0.5 | smd 0.71 x 0.28: P$1 -3.545,2.75; P$2 -3.545,2.25; P$3 -3.545,1.75; P$4 -3.545,1.25; P$5 -3.545,0.75; P$6 -3.545,0.25; P$7 -3.545,-0.25; P$8 -3.545,-0.75; P$9 -3.545,-1.25; P$10 -3.545,-1.75; P$11 -3.545,-2.25; P$12 -3.545,-2.75; P$25 3.545,-2.75; P$26 3.545,-2.25; P$27 3.545,-1.75; P$28 3.545,-1.25; P$29 3.545,-0.75; P$30 3.545,-0.25; P$31 3.545,0.25; P$32 3.545,0.75; P$33 3.545,1.25; P$34 3.545,1.75; P$35 3.545,2.25; P$36 3.545,2.75 | smd 0.28 x 0.71: P$13 -2.75,-3.545; P$14 -2.25,-3.545; P$15 -1.75,-3.545; P$16 -1.25,-3.545; P$17 -0.75,-3.545; P$18 -0.25,-3.545; P$19 0.25,-3.545; P$20 0.75,-3.545; P$21 1.25,-3.545; P$22 1.75,-3.545; P$23 2.25,-3.545; P$24 2.75,-3.545; P$37 2.75,3.545; P$38 2.25,3.545; P$39 1.75,3.545; P$40 1.25,3.545; P$41 0.75,3.545; P$42 0.25,3.545; P$43 -0.25,3.545; P$44 -0.75,3.545; P$45 -1.25,3.545; P$46 -1.75,3.545; P$47 -2.25,3.545; P$48 -2.75,3.545
TSSOP14 = smd 0.305 x 0.991: 1 -1.95,-2.918; 2 -1.3,-2.918; 3 -0.65,-2.918; 4 0,-2.918; 5 0.65,-2.918; 6 1.3,-2.918; 7 1.95,-2.918; 8 1.95,2.918; 9 1.3,2.918; 10 0.65,2.918; 11 0,2.918; 12 -0.65,2.918; 13 -1.3,2.918; 14 -1.95,2.918
SOT23-6 = smd 0.6 x 0.9: 1 -0.95,-1.15; 2 0,-1.15; 3 0.95,-1.15; 4 0.95,1.15; 5 0,1.15; 6 -0.95,1.15
RGC64 = smd 0.825 x 0.28: 1 -4.36,3.75; 2 -4.36,3.25; 3 -4.36,2.75; 4 -4.36,2.25; 5 -4.36,1.75; 6 -4.36,1.25; 7 -4.36,0.75; 8 -4.36,0.25; 9 -4.36,-0.25; 10 -4.36,-0.75; 11 -4.36,-1.25; 12 -4.36,-1.75; 13 -4.36,-2.25; 14 -4.36,-2.75; 15 -4.36,-3.25; 16 -4.36,-3.75; 33 4.36,-3.75; 34 4.36,-3.25; 35 4.36,-2.75; 36 4.36,-2.25; 37 4.36,-1.75; 38 4.36,-1.25; 39 4.36,-0.75; 40 4.36,-0.25; 41 4.36,0.25; 42 4.36,0.75; 43 4.36,1.25; 44 4.36,1.75; 45 4.36,2.25; 46 4.36,2.75; 47 4.36,3.25; 48 4.36,3.75 | smd 0.28 x 0.825: 17 -3.75,-4.36; 18 -3.25,-4.36; 19 -2.75,-4.36; 20 -2.25,-4.36; 21 -1.75,-4.36; 22 -1.25,-4.36; 23 -0.75,-4.36; 24 -0.25,-4.36; 25 0.25,-4.36; 26 0.75,-4.36; 27 1.25,-4.36; 28 1.75,-4.36; 29 2.25,-4.36; 30 2.75,-4.36; 31 3.25,-4.36; 32 3.75,-4.36; 49 3.75,4.36; 50 3.25,4.36; 51 2.75,4.36; 52 2.25,4.36; 53 1.75,4.36; 54 1.25,4.36; 55 0.75,4.36; 56 0.25,4.36; 57 -0.25,4.36; 58 -0.75,4.36; 59 -1.25,4.36; 60 -1.75,4.36; 61 -2.25,4.36; 62 -2.75,4.36; 63 -3.25,4.36; 64 -3.75,4.36 | smd 5 x 5: TP 0,0
SCHD3A0100 = smd 0.8 x 1.5: 1 -4.5,0; 2 -3.4,0; 3 -2.3,0; 4 -1.2,0; 5 -0.1,0; 6 1,0; 7 2.1,0; 8 3.2,0 | smd 1.45 x 0.9: GND1 -6.875,7.4; GND2 6.875,-4.3 | smd 1.45 x 2: MNT1 -6.875,5.7; MNT2 6.875,5.7; MNT3 -6.875,-2.6; MNT4 6.875,-2.6
TSX-3225 = smd 1.4 x 1.15: 1 -1.1,-0.8; 2 1.1,-0.8; 3 -1.1,0.8; 4 1.1,0.8

### Placement (x,y rotation side)
C1  94.93,62.9 0 top
C2  48.9,62.9 0 top
C3  6.35,7.02 90 top
C4  6.25,0.83 0 top
C5  7.86,2.02 0 top
C6  68.42,10.59 270 top
C7  66.75,14.8 0 top
C8  66.75,16.62 0 top
C9  66.2,7.65 0 top
C10  61.2,6.54 270 top
C11  62.07,1.94 270 top
C12  66.75,18.45 180 top
C13  56.67,19.4 90 top
C14  50.16,12.73 270 top
C15  51.12,4.79 0 top
C16  51.75,15.35 0 top
C17  53.02,12.34 0 top
C18  58.9,20.04 270 top
C19  62.71,21.07 270 top
C20  55.88,7.65 270 top
C21  58.42,6.54 90 top
C22  57.63,1.94 90 top
C23  60.8,23.13 270 top
C24  51.75,17.18 0 top
C25  10.48,11.14 180 top
C26  6.03,15.27 180 top
C27  8.89,14.32 270 top
C28  26.04,61.94 90 top
C29  6.67,62.9 0 top
C30  9.84,60.04 0 top
C31  33.66,65.75 90 top
C32  94.61,65.75 270 top
C33  48.58,65.75 270 top
C34  6.35,65.75 270 top
C35  1.27,60.36 270 top
C36  46.35,58.14 270 top
C37  31.43,61.94 90 top
C38  20.64,67.98 270 top
C39  38.42,66.07 0 top
C40  38.73,51.15 0 top
C41  39.37,48.61 0 top
C42  39.37,46.7 0 top
C43  24.77,47.02 135 top
C44  73.98,20.67 270 top
C45  78.11,20.67 270 top
C46  76.83,15.27 180 top
C47  80.33,20.67 270 top
C48  76.83,17.5 180 top
C49  75.88,20.67 90 top
C50  15.56,47.34 0 top
D1  40.96,60.99 90 top
D2  42.55,60.99 90 top
D3  92.71,66.07 90 top
D4  66.04,13.37 0 top
D5  7.54,9.88 270 top
D6  63.98,6.38 270 top
D7  52.39,6.7 0 top
D8  54.61,4.32 45 top
D9  39.37,60.99 90 top
D10  46.67,66.07 90 top
D11  4.45,66.07 90 top
D12  22.23,60.67 90 top
D13  27.62,60.67 90 top
GND  48.58,38.45 0 top
IC1  38.42,69.56 90 top
J1  74,30 90 top
L1  52.39,9.24 0 top
L2  2.22,12.73 90 top
R1  2.22,65.12 270 top
R2  90.49,69.25 270 top
R3  44.45,65.12 270 top
R4  97.79,63.22 90 top
R5  90.49,65.12 270 top
R6  51.75,63.22 90 top
R7  3.81,7.02 90 top
R8  5.08,7.02 90 top
R9  61.28,4.16 0 top
R10  60.48,1.94 270 top
R11  58.42,4.16 0 top
R12  59.21,1.94 90 top
R13  97.47,66.71 180 top
R14  1.75,9.08 180 top
R15  44.45,69.25 270 top
R16  51.44,66.71 180 top
R17  9.53,63.22 90 top
R18  9.21,66.71 180 top
R19  2.22,69.25 270 top
R20  9.84,58.45 180 top
R21  5.08,58.45 180 top
R22  24.45,38.45 45 top
R23  70.8,21.23 180 top
R24  7.62,7.02 90 top
R26  37.47,33.37 0 top
R27  70.8,19.96 180 top
SBW_CLK  40.64,37.18 270 top
SBW_DAT  40.64,39.72 270 top
SJ1  79.06,32.73 0 top
SJ2  53.02,1.94 315 top
SJ3  66.67,20.27 0 top
SJ4  63.82,3.21 90 top
SJ5  54.21,19.48 90 top
SJ6  58.42,23.84 0 top
SJ7  79.06,34.64 0 top
SJ8  79.06,36.55 0 top
SJ9  25.72,37.18 45 top
T1  4.68,9.88 90 top
U2  4.97,3.29 180 top
U5  6.03,12.73 0 top
U10  5.08,60.67 270 top
U11  47.31,60.99 90 top
U14  10.48,6.38 270 top
U$1  1.59,6.7 270 top
U$2  14.29,14 0 top
U$3  59.05,13.68 270 top
U$4  65.41,10.51 0 top
U$5  85.72,57.18 315 bottom
U$6  24.45,67.03 180 top
U$7  95.89,68.93 90 top
U$8  49.85,68.93 90 top
U$9  7.62,68.93 90 top
U$10  73.98,4.48 0 top
U$12  29.84,67.03 180 top
U$13  13.65,6.7 0 top
U$15  32.38,45.12 180 top
U$16  9.84,45.75 90 top
U$17  32.07,36.86 135 top
US1+  97.16,71.47 0 top
US1-  94.61,71.47 0 top
US2+  51.12,71.47 180 top
US2-  48.58,71.47 0 top
US3+  8.89,71.47 180 top
US3-  6.35,71.47 0 top
USB_5V  11.43,1.62 0 top
USB_D+  14.61,1.62 0 top
USB_D-  13.02,1.62 0 top
USB_GND  16.19,1.62 0 top

### Tracks (layer width: path | path; a pad name or v marks a point on that pad's centre or on a via)
3V3  (via drill 0.33 pad 0.69)  (1 unrouted)
  Top 0.279: U$3.P$10 57.3,17.93 C13.1 | C14.2 50.67,11.22 54.53,11.22 54.9,10.93 U$3.P$24 | C6.1 67.12,11.59 66.99,11.46 66.99,10.7 U$4.P$2 | U5.P$6 8.21,11.73 8.26,11.78 | U5.P$8 8.26,12.73 | 8.26,11.14 v4.68,11.14 v4.68,11.15 U5.P$5 | 8.26,12.73 8.26,11.78 | 8.26,11.78 8.26,11.14 | 8.26,12.73 8.3,12.73 C27.2 | 9.4,11.22 C25.2 8.26,11.14
  Top 0.305: 56.09,18.4 55.4,19.08 55.4,21.15 | D5.3 8.57,9.88 9.21,10.51 9.21,10.88 C25.2 | v4.68,11.15 4.76,11.15 v4.68,11.14
  Top 0.508: C6.1 69.72,11.59 v70.17,11.14 | C14.2 46.35,11.73 | 46.35,11.73 46.31,11.73 | C13.1 56.09,18.4 | 55.4,21.15 54.61,21.94 52.7,21.94 46.35,15.59 46.35,11.73 | v43.81,9.24 43.86,9.24 46.35,11.73
  Bottom 0.508: v70.17,11.14 67.94,8.92 62.55,8.92 61.28,10.19 58.1,10.19 57.15,9.24
  Bottom 0.762: 57.15,9.24 22.54,9.24 11.43,20.35 7.62,20.35 6.35,19.08 6.35,11.78 5.71,11.14 v4.68,11.14
3V3_EINK  (via drill 0.33 pad 0.69)
  Top 0.178: 75.09,33 75.09,34.5
  Top 0.203: J1.35 75.09,34.5 | 75.09,33 75.09,27.1 74.93,26.94 v74.93,25.2 J1.4
  Top 0.279: 62.24,15.43 63.27,15.43 63.82,15.99 63.82,18.61 64.29,19.08 64.29,20.91 v64.93,21.54
  Top 0.305: J1.30 75.09,33 | 75.09,34.5 75.42,34.5 75.72,34.8 J1.36 | C44.1 73.31,22.34 v72.07,22.34
  Bottom 0.406: 71.2,22.34 v72.07,22.34
  Bottom 0.508: v64.93,21.54 65.72,22.34 71.2,22.34 | v74.93,25.2 v72.07,22.34
15V  (via drill 0.33 pad 0.69)
  Top 0.279: 65.75,19.88 SJ3.1 | C12.2 65.01,18.45 64.77,18.21 64.77,15.67 63.54,14.43 U$3.P$44
  Top 0.305: SJ1.2 79.82,25.88 v79.06,25.11 78.54,24.6 J1.2 75.61,24.6 v75.56,24.56 | C45.1 v78.11,22.89
  Top 0.508: C12.2 65.75,20.11 SJ3.1 65.91,21.46 v66.04,21.58
  Bottom 0.305: v78.11,22.89 78.11,24.16 v79.06,25.11
  Bottom 0.508: v75.56,24.56 74.61,23.61 74.61,21.94 74.25,21.58 72.71,21.58 72.39,21.58 v66.04,21.58
22V  (via drill 0.33 pad 0.69)
  Top 0.279: 61.91,3.95 R9.2 | R9.2 62.15,4.16 62.71,4.72 62.71,5.26 D6.2 | SJ4.1 63.45,2.81 C11.1 62.07,4.1 R9.2
  Top 0.305: J1.23 74.21,30.9 v74.45,31.15 | C46.1 78.74,15.27 v79.38,15.91
  Top 0.508: SJ4.1 65.91,2.45 v66.04,2.57
  Bottom 0.508: v74.45,31.15 76.83,31.15 77.79,32.1 79.06,32.1 81.28,29.88 81.28,17.81 79.69,16.23 v79.38,15.91 v66.04,2.57
+3V3  (via drill 0.33 pad 0.69)
  Top 0.279: U5.P$1 4.68,14.6 C26.2 6.14,14.16 6.99,14.16 6.99,13.73 U5.10 7.02,13.73 | U10.P$8 7.89,61.42 v7.94,61.47 | R20.1 v11.75,58.45 | 62.24,14.93 61.93,14.93 v61.63,14.95 | U$15.15 38.13,48.37 | U$15.11 38.03,46.37
  Top 0.305: U$7.P$8 94.39,66.98 C32.1 93.71,66.75 93.03,66.07 v92.71,66.07 | U$8.P$8 48.35,66.98 C33.1 47.67,66.75 46.99,66.07 v46.67,66.07 | U$9.P$8 6.12,66.98 C34.1 5.45,66.75 4.76,66.07 v4.45,66.07 | IC1.16 35.5,66.77 v36.2,66.07 C39.1 | U$6.14 26.4,64.53 v26.99,65.12 | 31.75,64.8 v31.43,65.12 31.8,64.76 U$12.14 | v44.77,59.72 45.35,59.14 C36.1 46.04,58.82 46.04,58.77 45.81,59 U11.P$8 | C42.1 C41.1 38.13,48.37 | 38.35,46.37 C42.1 | 38.03,46.37 C42.1 | U$15.40 26.42,45.37 C43.1 25.33,46.31 | U$16.4 12.63,44.55 v13.34,43.85 | SJ9.1 v24.13,35.59 | R26.1 36.62,34.96 36.51,34.96 | C50.1 13.65,47.34 13.34,47.02 v13.34,46.07
  Top 0.406: v13.34,46.07 25.23,46.07 C43.1
  Top 0.508: v11.75,58.45 13.65,58.45 20.64,65.44 C38.2 20.68,67.03 31.43,67.03 | 31.43,67.03 v31.43,65.12 | v36.2,66.07 34.34,66.07 C31.2 33.38,67.03 31.43,67.03 | C35.1 v1.27,62.9 | C41.1 38.37,49.83 v38.42,49.8 v37.78,49.8
  Top 0.762: C26.2 v5.03,16.86 v5.03,17.81 v5.03,18.77 | v32.7,32.73 v33.34,32.73 35.56,34.96 36.51,34.96 41.91,34.96 43.5,36.55 v43.5,38.45 v43.5,39.09
  Bottom 0.152: 60.68,11.07 60.74,11.07 61.63,11.96
  Bottom 0.279: v61.63,14.95 61.91,14.95 | 47.31,59.72 48.26,59.72
  Bottom 0.305: v7.94,61.47 0.79,61.47 0.64,61.31 | v26.99,65.12 v31.43,65.12 | 51.12,63.85 51.12,60.99 50.16,60.04 49.85,59.72 48.26,59.72 | v44.77,59.72 47.31,59.72
  Bottom 0.406: v13.34,43.85 v13.34,46.07
  Bottom 0.508: 0.64,62.9 0.64,61.31 0.64,58.45 v11.75,58.45 22.23,58.45 24.77,55.91 25.92,55.91 26.67,55.16 26.67,53.05 25.4,51.78 | 0.64,62.9 0.64,64.8 1.91,66.07 v4.45,66.07 | v36.2,66.07 v46.67,66.07 48.9,63.85 51.12,63.85 53.98,63.85 56.2,66.07 v92.71,66.07 | v1.27,62.9 0.64,62.9 | 60.68,11.07 57.71,11.07 56.83,10.19 55.88,10.19 55.56,10.51 | v61.63,14.95 61.63,11.96 | 25.08,46.07 25.4,46.39 | v13.34,46.07 16.83,49.56 25.4,49.56
  Bottom 0.762: 11.75,21.62 7.3,21.62 5.03,19.35 v5.03,17.81 v5.03,16.86 | 11.75,21.62 22.86,10.51 55.56,10.51 | 25.4,51.78 25.4,49.56 25.4,46.39 25.4,36.86 | 25.4,36.86 v24.13,35.59 11.75,23.21 11.75,21.62 | 25.4,36.86 25.4,36.55 29.21,32.73 v33.34,32.73 | v43.5,38.45 43.5,44.12 38.37,49.24 38.37,49.8 v37.78,49.8
+5V  (via drill 0.33 pad 0.69)
  Top 0.178: U2.P$1 6.54,2.49 C5.1
  Top 0.279: U$15.53 30.64,39.24 11.11,19.72 11.11,18.77 10.48,18.13 v7.3,18.13 | 5.47,9.24 2.75,9.24
  Top 0.305: D5.2 6.03,9.22 | 6.03,9.22 T1.1 5.47,9.24 | v6.11,9.48 6.11,9.3 6.03,9.22 | 2.75,9.24 R14.1
  Top 0.508: U14.P$2 10.48,5.11 10.91,5.55 U$13.1
  Top 0.762: C5.1 7.01,2.28 v7.62,2.89 v8.26,3.53 8.57,3.84 10.33,3.84 U14.P$2
  Bottom 0.279: v6.11,9.48 7.3,10.67 v7.3,18.13
  Bottom 0.762: v8.26,3.53 v7.62,2.89 6.67,2.89 5.71,3.84 5.71,9.08 v6.11,9.48
-15V  (via drill 0.33 pad 0.69)
  Top 0.279: C23.2 | v60.8,20.67 60.8,20.27 60.64,20.11 60.64,19.4 60.88,19.16 60.88,18.21 60.8,18.13 U$3.P$3
  Top 0.305: SJ7.2 80.64,34.64 81.28,34.01 81.28,31.78 80.33,30.83 80.33,23.9 | C23.2 60.69,22.13 59.53,23.29 59.53,23.5 SJ6.2 | 80.33,23.9 J1.1 74.67,23.9 | C47.1 80.33,23.9
  Top 0.406: v71.6,23.05 73.82,23.05 74.67,23.9
  Top 0.508: v60.8,20.67 C23.2
  Bottom 0.508: v71.6,23.05 63.18,23.05 v60.8,20.67
-20V  (via drill 0.33 pad 0.69)
  Top 0.279: SJ2.2 53.56,1.71 D8.1 54.77,2.81 | C22.2 57.63,4.1 R11.1
  Top 0.305: J1.24 78.69,31.2 v78.74,31.15 | v56.52,2.81 C22.2 | C48.1 v79.69,17.5
  Top 0.508: C22.2 54.77,2.81
  Bottom 0.508: v56.52,2.81 65.01,2.81 v79.69,17.5 80.33,18.13 80.33,29.56 v78.74,31.15
CHRG_EN  (via drill 0.33 pad 0.69)
  Top 0.178: U2.P$4 6.44,3.69 7.62,4.87 R24.1 v7.62,6.86
  Top 0.279: v7.94,19.4 7.94,19.72 20.64,32.42 20.64,37.5 24.45,41.31 v24.45,41.62 | v24.45,43.85 24.93,43.37 U$15.44
  Bottom 0.279: v7.62,6.86 7.62,7.34 7.94,7.65 v7.94,19.4 | v24.45,41.62 v24.45,43.85
CHRG_STAT1  (via drill 0.33 pad 0.69)
  Top 0.178: U2.P$2 6.59,2.89 9.21,5.51 v9.21,6.38
  Top 0.279: v9.21,19.4 9.21,19.72 21.91,32.42 21.91,37.5 25.78,41.37 U$15.48
  Bottom 0.279: v9.21,6.38 v9.21,19.4
CHRG_STAT2  (via drill 0.33 pad 0.69)
  Top 0.178: U2.P$3 6.51,3.29 8.57,5.35 v8.57,7.02
  Top 0.279: v8.57,18.77 8.57,19.72 21.27,32.42 21.27,37.5 25.64,41.87 U$15.47
  Bottom 0.279: v8.57,7.02 v8.57,18.77
CKV  (via drill 0.33 pad 0.69)
  Top 0.279: U$15.19 35.13,51.68 36.51,53.05 37.47,53.05
  Top 0.305: v74.45,33.69 74.24,33.9 J1.33 69,33.9 49.85,53.05 37.47,53.05 | J1.38 75.37,35.4 v75.25,35.27
  Bottom 0.203: 75.88,33.05 76.52,33.69
  Bottom 0.305: v74.45,33.69 75.09,33.05 75.88,33.05 | 76.52,33.69 76.52,34.01 v75.25,35.27
CL  (via drill 0.33 pad 0.69)
  Top 0.279: U$15.21 34.13,51.95 36.51,54.33 v37.47,54.33 | 71.75,24.48 v69.22,24.48
  Top 0.305: J1.5 72.78,25.5 71.75,24.48
  Bottom 0.279: 68.58,24.48 v69.22,24.48
  Bottom 0.305: 68.58,24.48 38.73,54.33 v37.47,54.33
CS_TDC1  (via drill 0.33 pad 0.69)
  Top 0.279: U$6.11 v24.45,58.77 | v29.05,44.01 28.91,43.87 U$15.43
  Top 0.305: v31.11,56.23 v31.11,59.09
  Bottom 0.279: v24.45,58.77 24.45,59.09 v31.11,59.09
  Bottom 0.305: v31.11,56.23 31.11,46.07 v29.05,44.01
CS_TDC2  (via drill 0.33 pad 0.69)
  Top 0.279: v29.05,44.96 28.46,44.37 U$15.42 | 29.84,58.14 29.84,58.77
  Top 0.305: v29.84,56.23 29.84,58.14 | U$12.11 29.84,58.77
  Bottom 0.305: v29.05,44.96 30.48,46.39 30.48,55.59 v29.84,56.23
D0  (via drill 0.33 pad 0.69)
  Top 0.279: 67.94,26.38 v70.8,26.38
  Top 0.305: J1.12 77.53,27.6 v77.79,27.34 | 67.94,26.38 52.96,41.37 U$15.1
  Bottom 0.305: v77.79,27.34 71.75,27.34 v70.8,26.38
D1
  Top 0.279: 68.26,27.02 70.48,27.02
  Top 0.305: J1.13 71.36,27.9 70.48,27.02 | 68.26,27.02 53.41,41.87 U$15.2
D2  (via drill 0.33 pad 0.69)
  Top 0.305: J1.14 78.19,28.2 v78.42,27.97 | v70.17,27.66 68.58,27.66 53.87,42.37 U$15.3
  Bottom 0.279: 70.48,27.97 v78.42,27.97
  Bottom 0.305: 70.48,27.97 v70.17,27.66
D3
  Top 0.279: 68.9,28.29 69.85,28.29
  Top 0.305: J1.15 70.06,28.5 69.85,28.29 | 68.9,28.29 54.32,42.87 U$15.4
D4  (via drill 0.33 pad 0.69)
  Top 0.305: J1.16 78.3,28.8 v78.42,28.92 | v69.53,28.92 69.22,28.92 54.77,43.37 U$15.5
  Bottom 0.279: v78.42,28.92 v69.53,28.92
D5
  Top 0.279: 70.31,29.1 69.85,29.56 69.53,29.56 69.22,29.88
  Top 0.305: J1.17 70.31,29.1 | 69.22,29.88 55.23,43.87 U$15.6
D6  (via drill 0.33 pad 0.69)
  Top 0.305: J1.18 77.63,29.4 v77.79,29.56 | v69.85,30.2 55.68,44.37 U$15.7
  Bottom 0.305: v77.79,29.56 70.48,29.56 v69.85,30.2
D7
  Top 0.305: J1.19 71.3,29.7 56.13,44.87 U$15.8
DISCH1
  Top 0.279: U11.P$2 49.3,60.74 49.69,60.36 49.85,60.36 | 49.85,60.36 86.58,60.36 R5.2 | 49.85,60.04 49.85,60.36 | U$15.24 32.63,52.35 38.42,58.14 47.94,58.14
  Top 0.305: R5.2 92.61,64.27 D3.1 92.71,64.12 C1.1 | 49.85,60.04 48.26,58.45 47.94,58.14
DISCH2  (via drill 0.33 pad 0.69)
  Top 0.279: U$15.25 32.13,52.49 37.47,57.82 37.47,59.41
  Top 0.305: C2.1 46.67,64.12 D10.1 46.57,64.27 R3.2 v44.45,61.94 45.15,61.24 U11.P$6 | v37.47,60.67 37.47,59.41
  Bottom 0.279: 40.96,60.67 41.59,60.67
  Bottom 0.305: v44.45,61.94 43.18,60.67 41.59,60.67 | v37.47,60.67 40.96,60.67
DISCH3  (via drill 0.33 pad 0.69)
  Top 0.279: R1.2 v2.22,62.58 2.7,62.1 2.7,61.23 3,60.92 U10.P$2 | v28.89,48.61 28.89,47.66 28.6,47.37 U$15.36 | 27.3,56.55 v27.3,55.59
  Top 0.305: C29.1 4.45,64.12 D11.1 4.34,64.27 R1.2 | v20.64,61.31 20.64,58.77 22.54,56.87 26.99,56.87 27.3,56.55
  Bottom 0.279: v27.3,55.59 27.3,53.05 27.86,52.5 27.86,49.64 v28.89,48.61
  Bottom 0.305: v2.22,62.58 2.86,61.94 7.3,61.94 7.62,62.26 19.68,62.26 v20.64,61.31
END1
  Top 0.305: 24.45,69.88 U$6.4 24.45,71.15 25.4,72.11 31.11,72.11 34.63,68.59 IC1.14
END2
  Top 0.305: IC1.15 30.84,67.94 29.84,68.93 U$12.4
GMODE  (via drill 0.33 pad 0.69)
  Top 0.305: v74.37,32.1 J1.27 69.85,32.1 49.53,52.42 36.83,52.42 35.63,51.23 U$15.18 | J1.28 75.86,32.4 v75.8,32.34
  Bottom 0.305: v75.8,32.34 75.56,32.1 v74.37,32.1
GND  (via drill 0.33 pad 0.69)
  Top 0.152: 58.3,16.9 58.74,16.3
  Top 0.178: C21.1 58.42,0.99 57.7,0.99 C22.1 | R10.2 60.59,0.99 61.28,0.99 61.28,5.46 C10.2 | U2.ET 5.08,3.39 5.08,3.84 5.33,4.09 U2.P$5 6,4.44 6.03,4.48 6.35,4.48 v6.67,4.79
  Top 0.279: 62.24,16.43 61.8,16.43 61.63,16.27 v61.08,16.27 | C18.1 59.37,21.3 | U$3.P$6 59.3,16.29 v59.29,16.27 59.25,16.3 58.74,16.3 | U5.P$7 6.53,12.23 U5.POWERPAD | U5.POWERPAD 6.35,13.05 | U5.P$9 6.53,13.23 U5.POWERPAD | U5.P$3 U5.POWERPAD | U$3.P$8 58.3,16.9 | v58.74,22.26 58.74,21.3 59.05,20.99 59.05,21.94 v58.74,22.26
  Top 0.305: U$7.P$4 96.64,69.68 U$7.EP | U$8.P$4 50.6,69.68 U$8.EP | U$9.P$4 8.37,69.68 U$9.EP | 49.85,61.94 49.73,61.74 U11.P$4 48.06,61.74 U11.EP | R23.1 70.48,22.39 70.48,22.57
  other vias: 57.15,22.26 27.07,69.96 40.16,64.48 25.08,61.94 31.75,59.72 77.47,26.38 61.59,11.11 72.71,24.48 48.58,13.68 50.8,18.77 72.39,33.05 67.31,23.84 66.36,24.8 66.36,23.84 72.71,34.64 36.83,49.88 35.56,48.29 35.56,41.94 35.56,45.12 8.57,0.67 0.95,12.73 2.06,12.73 3.17,12.73 9.53,0.67 1.98,10.19 2.94,10.19 1.03,10.19 11.43,7.34 11.43,6.38 11.43,10.11 12.7,8.92 22.54,37.18 22.54,36.23 23.5,36.23 27.3,40.67 26.35,40.67 26.35,39.72 27.3,39.72 38.42,40.67 42.55,40.67 38.73,39.09 41.59,35.91 41.59,38.45 39.69,38.45 29.21,36.55 29.84,35.91 30.48,35.27 33.02,34.32 33.66,34.96 34.29,35.59 39.37,49.88 40.32,49.88 13.34,59.72 16.51,59.72 12.38,59.72 17.46,59.72
  pour Top: -2.54,75.28 101.6,75.28 101.6,-2.54 -2.54,-2.54
  pour Bottom: 0,-6 0,74.01 100.01,74.01 100.01,0.03 100.01,-6
LE  (via drill 0.33 pad 0.69)
  Top 0.279: U$15.20 34.63,51.81 36.51,53.69 v36.83,53.69
  Top 0.305: v75.56,26.38 75.56,26.15 75.91,25.8 J1.6
  Bottom 0.279: 38.42,53.69 v36.83,53.69
  Bottom 0.305: v75.56,26.38 72.39,26.38 69.81,23.8 68.3,23.8 38.42,53.69
MISO  (via drill 0.33 pad 0.69)
  Top 0.279: U$6.9 23.15,59.75 v23.18,59.72 | U$15.38 27.01,46.37 25.72,47.66 25.72,51.15 28.57,54.01 v28.57,59.72
  Top 0.305: U$12.9 28.55,59.75 v28.57,59.72
  Bottom 0.279: v23.18,59.72 v28.57,59.72
MISO2  (via drill 0.33 pad 0.69)
  Top 0.305: U$15.46 12.28,42.37 v12.06,42.58 | v11.43,47.66 11.23,47.85 U$16.7
  Bottom 0.305: v12.06,42.58 12.06,47.02 v11.43,47.66
MOSI  (via drill 0.33 pad 0.69)
  Top 0.203: 23.8,60.13 23.8,59.31 | 29.2,60.06 29.2,59.39
  Top 0.279: 29.2,58.47 v29.21,58.45 | U$15.37 27.14,46.87 26.35,47.66 26.35,51.15 29.21,54.01 29.21,56.87
  Top 0.305: 29.21,56.87 v29.21,58.45 | U$6.10 23.8,60.13 | v23.8,58.15 23.8,59.31 | 29.2,58.47 29.2,59.39 | U$12.10 29.2,60.06
  Bottom 0.229: v23.8,58.15 24.78,58.15
  Bottom 0.279: 29.2,58.47 v29.21,58.45 25.08,58.45 24.78,58.15
MOSI2
  Top 0.305: U$15.45 13.04,42.87 12.46,43.45 U$16.3
N$1
  Top 0.305: 96.91,71.47 US1+.1 98.11,71.47 98.42,71.15 98.42,69.56 98.04,69.18 U$7.P$3
N$2
  Top 0.305: R5.1 R2.2 91.84,69.18 U$7.P$6
N$3
  Top 0.279: U$6.8 22.5,63.81 22.23,63.53 D12.2
N$4
  Top 0.305: U$8.P$3 52,69.18 52.39,69.56 52.39,71.15 52.07,71.47 US2+.1
N$5
  Top 0.305: U$8.P$2 52,68.68 52.39,68.3 52.39,66.81 R16.1 52.28,65.17 R6.2
N$6  (via drill 0.33 pad 0.69)
  Top 0.305: U$8.P$1 51.35,67.47 R16.2 50.59,65.86 v50.16,65.44 | U$8.P$5 47.83,69.68 v47.31,70.2
  Bottom 0.305: v47.31,70.2 50.16,67.34 v50.16,65.44
N$7
  Top 0.279: U$3.P$40 63.32,12.43 63.82,11.94 | 63.82,11.94 63.82,10.7 U$4.P$1 | D4.2 66.36,13.37 65.09,12.1 63.98,12.1 63.82,11.94
N$8
  Top 0.178: U2.P$9 2.86,2.89 U$1.TH
N$9
  Top 0.305: U$13.3 USB_D+.1
N$10
  Top 0.305: U$13.2 13.65,3.84 13.02,3.21 USB_D-.1
N$11
  Top 0.279: U$15.57 32.63,40.29 32.07,39.72 31.75,39.72 30.64,38.61 30.64,37.16 U$17.4
N$12
  Top 0.178: U2.P$8 3.25,3.29 2.86,3.68 2.86,5.21 R7.1
N$13
  Top 0.178: U2.P$7 3.41,3.69 3.25,3.84 3.25,4.56 3.81,5.11 4.76,5.11 5.08,5.43 R8.1
N$14  (via drill 0.33 pad 0.69)
  Top 0.279: U$3.P$43 U$3.P$42 64.27,13.43 | 64.27,13.43 D4.1 | 64.27,13.43 64.68,13.43 65.56,14.32 65.56,14.61 C7.1 | U$3.P$37 62.6,9.98 v62.71,9.88 | v64.45,14.4 64.85,14.8 C7.1 | C8.1 C7.1
  Bottom 0.508: v64.45,14.4 64.45,11.62 v62.71,9.88
N$15
  Top 0.305: U$7.P$7 93.09,68.68 92.71,68.3 D3.2
N$16
  Top 0.279: U$12.8 27.89,63.81 27.62,63.53 D13.2
N$17
  Top 0.178: U2.P$6 3.95,4.46 4.21,4.72 5.56,4.72 6.35,5.51 C3.1
N$18
  Top 0.279: U$3.P$34 60.8,7.93 C10.1 61.41,7.33 D6.1
N$19
  Top 0.305: D5.1 T1.3
N$20
  Top 0.279: U$3.P$36 61.8,9.66 63.18,8.29 63.66,8.29 64.29,7.65 C9.1
N$21
  Top 0.279: C9.2 67.07,6.78 66.67,6.38 D6.3
N$22
  Top 0.279: 60.3,4.28 R9.1 | R9.1 60.43,3 R10.1 | U$3.P$33 60.3,9.54 60.09,9.32 60.09,4.5 R9.1
N$23
  Top 0.279: D8.3 54.2,5.1 C20.2
N$24
  Top 0.279: D7.1 51.75,6.7 52.39,7.34 52.39,8.92 52.7,9.24 L1.P$2 53.81,10.14 U$3.P$25
N$25
  Top 0.279: 55.87,14.93 57.47,14.93 | 57.47,14.93 57.8,14.93 U$3.EP16 | U$3.EP16 U$3.EP | 55.87,11.93 58.3,11.93 U$3.EP6 | U$3.EP7 57.3,11.93 U$3.P$27 U$3.P$26 | U$3.P$26 56.8,10.16 56.83,10.19 | D7.2 54.29,6.7 | U$3.P$26 56.8,9.69 56.52,9.4 55.01,9.4 54.93,9.32 54.93,7.18 54.69,6.94 54.33,6.94 D7.2 | D7.2 53.74,6.7 52.47,5.43 52.47,5.14 C15.2 | U$3.P$22 54.5,11.93 C17.2 | 60.3,16.88 60.3,14.66 60.55,14.41 U$3.EP2 | U$3.EP2 U$3.EP1 | U$3.EP2 U$3.EP14 | U$3.EP14 U$3.EP12 | U$3.EP16 U$3.EP13 | U$3.EP13 U$3.EP15 | U$3.EP14 U$3.EP15 | U$3.EP2 U$3.EP3 U$3.EP4 | U$3.EP5 U$3.EP15 | U$3.EP6 U$3.EP13 | U$3.EP7 U$3.EP6 | U$3.EP8 U$3.EP7 | U$3.EP9 U$3.EP10 | U$3.EP10 U$3.EP11 | U$3.EP10 57.55,15.02 57.47,14.93 | U$3.P$16 52.77,14.93 C16.2
N$26
  Top 0.279: U$3.P$7 58.8,18.33 C18.2
N$27
  Top 0.279: U$3.P$1 61.8,17.7 61.91,17.81 61.91,19.27 C19.2
N$28
  Top 0.279: 56.2,4.07 D8.2 57.31,5.46 57.31,6.54 58.31,7.54 C21.2 58.8,7.29 U$3.P$30
N$29
  Top 0.279: U$3.P$9 57.8,23.06 SJ6.1
N$30
  Top 0.279: U5.P$4 3.94,12.23 3.89,12.18 3.89,11.54 3.81,11.46 2.35,11.46 L2.P$1
N$31
  Top 0.279: U$3.P$28 57.8,9.66 56.68,8.53 C20.1
N$32
  Top 0.279: R12.2 59.27,3 R11.2 59.61,4.5 59.61,9.32 59.3,9.62 U$3.P$31
N$33
  Top 0.279: U$3.P$29 58.3,9.44 56.83,7.97 56.83,6.06 56.52,5.75 56.04,5.75 52.77,2.48 SJ2.1
N$34  (via drill 0.33 pad 0.69)
  Top 0.279: U$3.P$19 56.27,13.43 v56.48,13.68
  Top 0.305: SJ3.2 68.5,20.27 v68.58,20.35
  Bottom 0.279: v56.48,13.68 56.48,15.87 57.55,16.94 57.94,17.34 58.74,18.13 66.36,18.13 v68.58,20.35
N$35  (via drill 0.33 pad 0.69)
  Top 0.254: v63.86,6.38 63.86,4.01 SJ4.2
  Top 0.279: U$3.P$35 61.3,8.97 v61.52,8.76 | 63.86,4.05 SJ4.2
  Bottom 0.279: v61.52,8.76 61.52,8.72 v63.86,6.38
N$36
  Top 0.279: U$3.P$14 54.9,15.93 54.29,16.54 54.29,18.45 54.66,18.45 SJ5.1
N$37
  Top 0.279: U5.P$2 3.94,13.23 3.89,13.29 3.89,13.92 3.81,14 2.35,14 L2.P$2
N$38
  Top 0.279: U$6.13 25.75,63.11 C28.2
N$39
  Top 0.305: U$7.P$2 98.04,68.68 98.42,68.3 98.42,66.71 R13.1 98.32,65.17 R4.2
N$40  (via drill 0.33 pad 0.69)
  Top 0.305: U$7.P$1 97.39,67.47 R13.2 96.62,65.86 v96.2,65.44 | 93.66,69.88 v93.34,70.2 93.86,69.68 U$7.P$5
  Bottom 0.305: v96.2,65.44 96.2,67.34 v93.34,70.2
N$41
  Top 0.305: R3.1 R15.2 45.8,69.18 U$8.P$6
N$42  (via drill 0.33 pad 0.69)
  Top 0.508: USB_5V.1 v10,1.62 | v10.48,7.02 U14.P$1
  Bottom 0.508: v10,1.62 10,6.54 v10.48,7.02
N$43
  Top 0.305: U$9.P$3 9.78,69.18 10.16,69.56 10.16,71.15 9.84,71.47 US3+.1
N$44
  Top 0.305: R17.2 10.06,65.17 R18.1 10.16,66.81 10.16,68.3 9.78,68.68 U$9.P$2
N$45  (via drill 0.33 pad 0.69)
  Top 0.305: U$9.P$1 9.12,67.47 R18.2 8.36,65.86 v7.94,65.44 | U$9.P$5 5.6,69.68 v5.08,70.2
  Bottom 0.305: v5.08,70.2 7.94,67.34 v7.94,65.44
N$46
  Top 0.305: R1.1 R19.2 3.58,69.18 U$9.P$6
N$47
  Top 0.305: U$8.P$7 47.06,68.68 46.67,68.3 D10.2
N$48
  Top 0.305: U$9.P$7 4.83,68.68 4.45,68.3 D11.2
N$49
  Top 0.279: U$12.13 31.14,63.11 C37.2
N$50
  Top 0.305: SJ8.1 SJ7.1 | SJ7.1 SJ1.1 | J1.34 77.86,34.2 SJ7.1
N$51
  Top 0.279: U$15.64 37.06,40.76 38.1,39.72 SBW_DAT.1
N$52
  Top 0.279: U$15.59 33.63,38.47 35.24,36.86 35.24,36.55 35.56,36.23 37.15,36.23 38.1,37.18 SBW_CLK.1
N$53
  Top 0.305: C40.1 36.51,51.15 36.13,50.77 U$15.17
N$54  (via drill 0.33 pad 0.69)
  Top 0.279: U$15.51 29.64,39.83 v29.53,39.72 | R22.2 26.26,37.84 SJ9.2 v28.26,39.72
  Bottom 0.279: v29.53,39.72 v28.26,39.72
N$56
  Top 0.279: U$17.1 33.41,38.06 33.13,38.34 U$15.58
N$57
  Top 0.279: U$3.P$47 63.05,15.93 63.34,16.23 63.34,18.77 63.82,19.24 63.82,21.46 64.61,22.26 68.92,22.26 R23.2
  Top 0.305: R27.2 R23.2
OE  (via drill 0.33 pad 0.69)
  Top 0.279: U$15.22 33.63,52.08 36.51,54.96 v36.83,54.96
  Top 0.305: J1.7 72.42,26.1 71.44,25.11 v69.85,25.11
  Bottom 0.279: 68.9,25.11 v69.85,25.11 | 39.05,54.96 v36.83,54.96
  Bottom 0.305: 68.9,25.11 39.05,54.96
POW_INT  (via drill 0.33 pad 0.69)
  Top 0.279: 61.3,16.88 61.3,17.92 61.36,17.97 v61.36,19.72
  Top 0.305: U$15.32 28.64,50.77 v28.5,50.83
  Bottom 0.279: 29.84,48.61 29.84,46.39 29.21,45.75 28.89,45.75 28.42,45.28 28.42,43.69 28.89,43.21
  Bottom 0.305: v28.5,50.83 28.57,49.88 29.84,48.61 | 28.89,43.21 33.34,43.21 56.83,19.72 v61.36,19.72
PWR_GOOD  (via drill 0.33 pad 0.69)
  Top 0.279: U$3.P$23 56.23,11.43 v56.52,11.14 | v35.88,37.81 34.63,39.06 U$15.61
  Bottom 0.279: v56.52,11.14 55.24,12.41 55.24,16.23 | 55.88,17.18 55.88,17.81
  Bottom 0.305: 55.24,16.23 55.24,16.54 55.88,17.18 | 55.88,17.81 55.56,18.13 v35.88,37.81
PWRUP  (via drill 0.33 pad 0.69)
  Top 0.279: U$3.P$21 56.22,12.43 v56.48,12.73 | v35.88,38.77 35.13,39.51 U$15.62
  Bottom 0.279: v56.48,12.73 55.84,13.37 55.84,15.87 56.52,16.54 56.52,17.81
  Bottom 0.305: 56.52,17.81 56.52,18.13 v35.88,38.77
SCL  (via drill 0.33 pad 0.69)
  Top 0.279: U$3.P$17 54.09,14.43 v53.34,13.68 | U$15.35 27.2,47.87 v27.15,47.82
  Bottom 0.305: v53.34,13.68 53.34,17.5 29.21,41.62 28.57,41.62 27.15,43.05 v27.15,47.82
SCLK
  Top 0.279: U$6.12 25.1,65.45 25.4,65.75 30.16,65.75 30.5,65.42 U$12.12 30.48,64.09 30.48,55.83 | U$15.33 28.02,49.8 27.62,50.2 27.62,51.78 28.02,52.19
  Top 0.305: 28.02,52.19 30.48,54.64 30.48,55.83
SCLK2
  Top 0.305: U$15.41 13.27,44.87 12.48,45.65 U$16.5
SDA  (via drill 0.33 pad 0.69)
  Top 0.279: U$3.P$18 54.6,13.93 v54.36,13.7 | U$15.34 27.55,48.37 v26.99,48.93
  Top 0.305: R26.2 38.42,33.37 v39.37,32.42
  Bottom 0.305: v26.99,48.93 27.94,47.98 27.94,43.21 28.57,42.58 29.21,42.58 v39.37,32.42 54.37,17.42 54.37,13.61 v54.36,13.7
SPH  (via drill 0.33 pad 0.69)
  Top 0.279: U$15.23 33.13,52.22 36.51,55.59 v37.47,55.59 | 71.12,25.75 v69.22,25.75
  Top 0.305: J1.11 72.67,27.3 71.12,25.75
  Bottom 0.305: v69.22,25.75 39.37,55.59 v37.47,55.59
SPV  (via drill 0.33 pad 0.69)
  Top 0.279: U$15.9 54.54,45.37 v54.93,45.75
  Top 0.305: J1.37 74.44,35.1 v74.37,35.12 | J1.32 75.89,33.6 v75.68,33.77
  Bottom 0.305: v54.93,45.75 63.74,45.75 v74.37,35.12 74.37,35.08 v75.68,33.77
STRT  (via drill 0.33 pad 0.69)
  Top 0.279: D9.1 D1.1 | D1.1 D2.1 | D1.1 39.48,59.29 39.37,59.41
  Top 0.305: U$12.3 30.5,71.14 v30.48,71.15 | U$6.3 25.1,70.85 25.4,71.15 v26.04,71.15 | IC1.6 39.66,70.54 v39.05,71.15 | 39.37,59.41 39.37,60.67 v35.24,64.8
  Bottom 0.279: 33.97,71.15 34.61,71.15
  Bottom 0.305: v26.04,71.15 v30.48,71.15 33.02,71.15 | 33.02,71.15 33.02,67.03 v35.24,64.8 | 33.02,71.15 33.97,71.15 | 34.61,71.15 v39.05,71.15
TDC_CLK  (via drill 0.33 pad 0.69)
  Top 0.279: U$15.30 29.64,53.16 33.02,56.55 33.02,59.72
  Top 0.305: 29.2,67.98 24.45,67.98 23.8,68.63 U$6.5 | U$12.5 29.2,67.98 | 29.2,67.98 v29.84,67.98 | v33.02,61.94 33.02,59.72
  Bottom 0.305: v29.84,67.98 33.02,64.8 v33.02,61.94
TDC_EN  (via drill 0.33 pad 0.69)
  Top 0.279: U$15.29 30.14,53.03 33.97,56.87 v33.97,62.9
  Top 0.305: U$6.1 26.4,69.04 v26.67,68.77 | U$12.1 31.8,68.82 v31.75,68.77
  Bottom 0.305: v26.67,68.77 v31.75,68.77 31.75,67.03 33.97,64.8 v33.97,62.9
TDC_INT  (via drill 0.33 pad 0.69)
  Top 0.279: v28.89,52.1 29.14,51.86 U$15.31
  Top 0.305: v27.94,56.23 27.94,57.18 27.62,57.5 | D13.1 27.62,57.5 | D12.1 22.23,58.45 23.18,57.5 27.62,57.5
  Bottom 0.279: v27.94,56.23 27.94,53.05
  Bottom 0.305: 27.94,53.05 28.1,52.9 v28.89,52.1
US1  (via drill 0.33 pad 0.69)
  Top 0.279: 38.42,65.12 v38.89,64.64 39.37,64.17 D9.2 39.37,61.63 40.32,60.67 42.86,60.67 43.81,59.72 v43.81,58.77 | U11.P$1 48.81,59.71 48.18,59.09 | U$15.26 31.64,52.62 36.51,57.5 36.51,59.41
  Top 0.305: IC1.12 IC1.11 34.31,70.54 v34.29,70.52 | 38.42,65.12 38.42,67.03 v37.47,67.98 | v34.92,63.22 35.88,63.22 36.51,62.58 36.51,59.41 | 48.18,59.09 v47.78,59.09
  Bottom 0.279: 44.45,59.09 45.09,59.09
  Bottom 0.305: v37.47,67.98 34.92,70.52 v34.29,70.52 | v38.89,64.64 36.35,64.64 v34.92,63.22 | v43.81,58.77 44.13,59.09 44.45,59.09 | 45.09,59.09 v47.78,59.09
US2  (via drill 0.33 pad 0.69)
  Top 0.279: U11.P$7 43.75,60.74 43.18,61.31 v41.27,61.31 40.96,61.63 D1.2 40.96,67.29 IC1.1 | U$15.28 30.64,52.89 34.61,56.87 34.61,59.41
  Top 0.305: IC1.1 39.98,67.29 38.03,69.24 IC1.13 | v34.61,61.31 34.61,59.41
  Bottom 0.305: v34.61,61.31 34.77,61.47 41.12,61.47 v41.27,61.31
US3  (via drill 0.33 pad 0.69)
  Top 0.279: IC1.2 41.95,67.94 42.55,67.34 v42.55,64.17 D2.2 | U10.P$1 3.58,63.13 v3.49,63.22 | U$15.27 31.14,52.76 35.56,57.18 35.56,59.41
  Top 0.305: IC1.2 40.04,67.94 36.79,71.19 IC1.10 34.57,71.19 33.02,72.74 v16.51,72.74 | v35.56,62.26 35.56,59.41
  Bottom 0.305: v16.51,72.74 6.35,62.58 4.13,62.58 v3.49,63.22 | v42.55,64.17 40.64,62.26 v35.56,62.26
USB_D+  (via drill 0.33 pad 0.69)
  Top 0.279: U$15.50 29.14,40.28 28.89,40.04 28.89,38.77 9.84,19.72 v9.84,18.77 | U$13.4 14.6,8.61 v13.65,9.56
  Bottom 0.279: v13.65,9.56 9.84,13.37 v9.84,18.77
USB_D-  (via drill 0.33 pad 0.69)
  Top 0.203: 30.14,39.38 U$15.52
  Top 0.279: 30.14,39.38 10.48,19.72 v10.48,19.4 | U$13.5 v13.65,8.61
  Bottom 0.279: v13.65,8.61 14.29,9.24 14.29,9.88 10.48,13.68 v10.48,19.4
VBAT  (via drill 0.33 pad 0.69)
  Top 0.178: 3.95,1.68 v3.65,1.38 | U2.P$10 3.95,2.27 4.13,2.1 5.24,2.1 5.71,1.62 5.71,1.15 C4.1
  Top 0.305: T1.2 v4.68,9.88
  Top 0.762: 1.59,1.39 U$1.P+ 1.82,1.39 v2.86,1.39 4.84,1.39 C4.1 | v3.65,1.38 v4.45,1.38
  Bottom 0.305: v4.45,1.39 v4.45,1.38
  Bottom 0.762: v2.86,1.39 v4.45,1.39 4.68,1.62 v4.68,9.88
VCOM  (via drill 0.33 pad 0.69)
  Top 0.279: U$3.P$15 54.21,15.43 53.74,15.91 53.74,17.1 53.66,17.18 C24.2 | 55.87,15.43 56.04,15.43 56.87,16.27 v58.02,16.27
  Top 0.305: J1.22 77.38,30.6 v77.47,30.51 | C49.2 75.88,22.57 v75.41,23.05
  Bottom 0.508: v77.47,30.51 78.11,30.51 79.38,29.24 79.38,27.02 v75.41,23.05 75.41,21.46 71.44,17.5 59.25,17.5 v58.02,16.27
VCOM_CTRL  (via drill 0.33 pad 0.69)
  Top 0.279: 56.3,16.88 56.3,17.07 56.2,17.18 55.56,17.18 v55.24,17.5 | v35.88,36.86 34.13,38.6 U$15.60
  Bottom 0.305: v55.24,17.5 v35.88,36.86
VCOMP  (via drill 0.33 pad 0.69)
  Top 0.279: U10.P$7 U10.P$6 7.62,60.42 v7.78,60.44 | U10.P$3 2.55,60.42 v2.54,60.44 | U11.P$5 45.81,62.81 v45.72,62.9 | U11.P$3 49.76,61.24 v50.01,60.99
  Bottom 0.279: v2.54,60.44 v7.78,60.44 7.94,60.44 7.94,60.42 7.77,60.42 | v50.01,60.99 48.1,62.9 47.31,62.9 v45.72,62.9
  Bottom 0.305: 47.31,62.9 47.31,61.63 46.1,60.42 44.2,60.42 43.5,59.72 37.15,59.72 36.43,60.44 v7.78,60.44
VCOMP_BEFORE
  Top 0.279: U10.P$5 7.1,59.92 7.3,59.72 8.65,59.72 C30.1 8.99,60.02 R20.2 R21.1
WAKEUP  (via drill 0.33 pad 0.69)
  Top 0.279: 59.8,16.88 59.8,17.85 60.25,18.29 v60.25,18.77 | v35.88,39.72 35.63,39.96 U$15.63
  Bottom 0.305: v60.25,18.77 56.83,18.77 v35.88,39.72
(copper drawn outside any net)
  shapes: Bottom area x1

### Text on the board
tNames: 5V | D- | D+ | GND